# EAGLE schematic VNA (EAGLE 9.3.1)

## Sheet 1 of 10
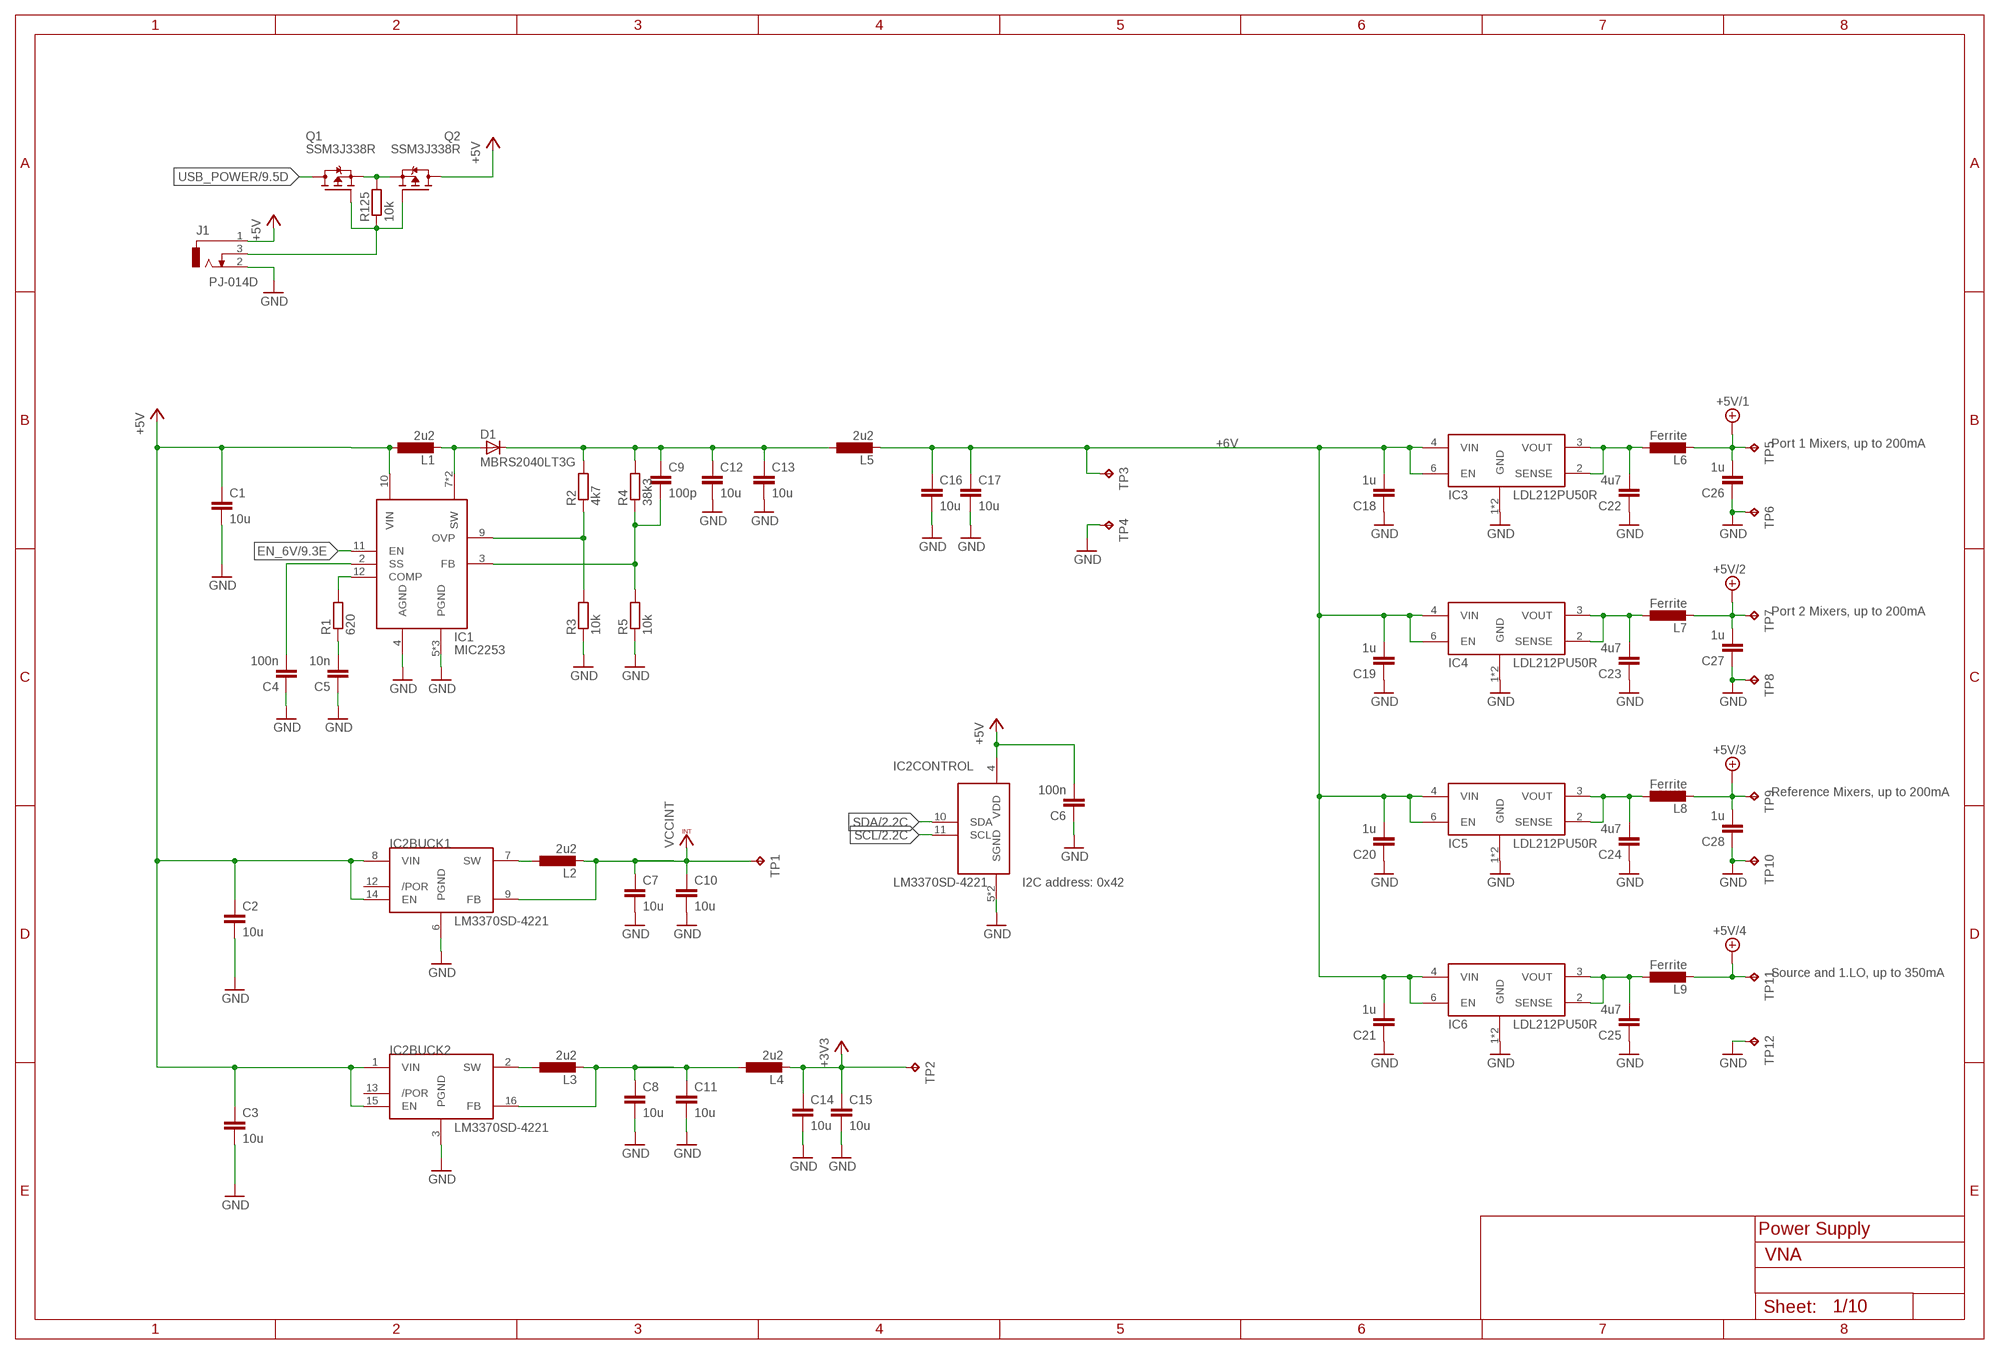
[diagram p0: schematic, sheet 1]

### Parts
C1  10u  C-EUC1206  [C1206]
C2  10u  C-EUC1206  [C1206]
C3  10u  C-EUC1206  [C1206]
C4  100n  C-EUC0402:2  [C0402]
C5  10n  C-EUC0402:2  [C0402]
C6  100n  C-EUC0402:2  [C0402]
C7  10u  C-EUC1206  [C1206]
C8  10u  C-EUC1206  [C1206]
C9  100p  C-EUC0402:2  [C0402]
C10  10u  C-EUC1206  [C1206]
C11  10u  C-EUC1206  [C1206]
C12  10u  C-EUC1206  [C1206]
C13  10u  C-EUC1206  [C1206]
C14  10u  C-EUC1206  [C1206]
C15  10u  C-EUC1206  [C1206]
C16  10u  C-EUC1206  [C1206]
C17  10u  C-EUC1206  [C1206]
C18  1u  C-EUC0603:1  [C0603]
C19  1u  C-EUC0603:1  [C0603]
C20  1u  C-EUC0603:1  [C0603]
C21  1u  C-EUC0603:1  [C0603]
C22  4u7  C-EUC0603:1  [C0603]
C23  4u7  C-EUC0603:1  [C0603]
C24  4u7  C-EUC0603:1  [C0603]
C25  4u7  C-EUC0603:1  [C0603]
C26  1u  C-EUC0603:1  [C0603]
C27  1u  C-EUC0603:1  [C0603]
C28  1u  C-EUC0603:1  [C0603]
D1  MBRS2040LT3G  D-SMB  [SMB]
IC1  MIC2253  [SON50P300X300X90-13T170X240N]
IC2  LM3370SD-4221  LM3370  [SON50P400X500X80-17T260X400N]
IC3  LDL212PU50R  [SON95P300X300X100-7T170X240N]
IC4  LDL212PU50R  [SON95P300X300X100-7T170X240N]
IC5  LDL212PU50R  [SON95P300X300X100-7T170X240N]
IC6  LDL212PU50R  [SON95P300X300X100-7T170X240N]
J1  PJ-014D  [PJ-014D]
L1  2u2  SRN5040  [SRN5040]
L2  2u2  SRN5040  [SRN5040]
L3  2u2  SRN5040  [SRN5040]
L4  2u2  SRN5040  [SRN5040]
L5  2u2  SRN5040  [SRN5040]
L6  Ferrite  FERRITE  [R0402]
L7  Ferrite  FERRITE  [R0402]
L8  Ferrite  FERRITE  [R0402]
L9  Ferrite  FERRITE  [R0402]
Q1  SSM3J338R  [SOTFL95P240X80-3N]
Q2  SSM3J338R  [SOTFL95P240X80-3N]
R1  620  R-EU_R0402  [R0402]
R2  4k7  R-EU_R0402  [R0402]
R3  10k  R-EU_R0402  [R0402]
R4  38k3  R-EU_R0402  [R0402]
R5  10k  R-EU_R0402  [R0402]
R125  10k  R-EU_R0402  [R0402]
TP1  TPB1,27  [B1,27]
TP2  TPB1,27  [B1,27]
TP3  TPB1,27  [B1,27]
TP4  TPB1,27  [B1,27]
TP5  TPB1,27  [B1,27]
TP6  TPB1,27  [B1,27]
TP7  TPB1,27  [B1,27]
TP8  TPB1,27  [B1,27]
TP9  TPB1,27  [B1,27]
TP10  TPB1,27  [B1,27]
TP11  TPB1,27  [B1,27]
TP12  TPB1,27  [B1,27]

### Nets
+3V3: C14.1 C15.1 L4.P$2 TP2.TP ; also sheet 2,3,4,5,6,7,8,9,10
+5V: C1.1 C2.1 C3.1 C6.2 IC1.10(VIN) IC2.1(BUCK2:VIN) IC2.4(CONTROL:VDD) IC2.8(BUCK1:VIN) IC2.14(BUCK1:EN) IC2.15(BUCK2:EN) J1.1 L1.P$1 Q2.3(D)
+5V/1: C26.2 L6.2 TP5.TP ; also sheet 6
+5V/2: C27.2 L7.2 TP7.TP ; also sheet 7
+5V/3: C28.2 L8.2 TP9.TP ; also sheet 8
+5V/4: L9.2 TP11.TP ; also sheet 3,5
+6V: C16.1 C17.1 C18.2 C19.2 C20.2 C21.2 IC3.4(VIN) IC3.6(EN) IC4.4(VIN) IC4.6(EN) IC5.4(VIN) IC5.6(EN) IC6.4(VIN) IC6.6(EN) L5.P$2 TP3.TP
EN_6V: IC1.11(EN) ; also sheet 9
GND: C1.2 C2.2 C3.2 C4.1 C5.1 C6.1 C7.2 C8.2 C10.2 C11.2 C12.2 C13.2 C14.2 C15.2 C16.2 C17.2 C18.1 C19.1 C20.1 C21.1 C22.1 C23.1 C24.1 C25.1 C26.1 C27.1 C28.1 IC1.4(AGND) IC1.5(PGND) IC1.6(PGND) IC1.13(PGND) IC2.3(BUCK2:PGND) IC2.5(CONTROL:SGND) IC2.6(BUCK1:PGND) IC2.17(CONTROL:SGND) IC3.1(GND) IC3.7(GND) IC4.1(GND) IC4.7(GND) IC5.1(GND) IC5.7(GND) IC6.1(GND) IC6.7(GND) J1.2 R3.1 R5.1 TP4.TP TP6.TP TP8.TP TP10.TP TP12.TP ; also sheet 2,3,4,5,6,7,8,9,10
N$34: D1.A IC1.7(SW) IC1.8(SW) L1.P$2
N$65: IC1.12(COMP) R1.2
N$100: C22.2 IC3.2(SENSE) IC3.3(VOUT) L6.1
N$158: C9.2 IC1.3(FB) R4.1 R5.2
N$161: C23.2 IC4.2(SENSE) IC4.3(VOUT) L7.1
N$162: IC1.9(OVP) R2.1 R3.2
N$164: C24.2 IC5.2(SENSE) IC5.3(VOUT) L8.1
N$165: C4.2 IC1.2(SS)
N$166: C25.2 IC6.2(SENSE) IC6.3(VOUT) L9.1
N$167: Q1.2(S) Q2.2(S) R125.2
N$168: J1.3 Q1.1(G) Q2.1(G) R125.1
N$171: IC2.7(BUCK1:SW) L2.P$1
N$177: C9.1 C12.1 C13.1 D1.C L5.P$1 R2.2 R4.2
N$181: IC2.2(BUCK2:SW) L3.P$1
N$183: C8.1 C11.1 IC2.16(BUCK2:FB) L3.P$2 L4.P$1
N$225: C5.2 R1.1
SCL: IC2.11(CONTROL:SCL) ; also sheet 2,9
SDA: IC2.10(CONTROL:SDA) ; also sheet 2,9
USB_POWER: Q1.3(D) ; also sheet 9
VCCINT: C7.1 C10.1 IC2.9(BUCK1:FB) L2.P$2 TP1.TP ; also sheet 9
Unconnected: IC2.12(BUCK1:/POR) IC2.13(BUCK2:/POR)

### Notes on the sheet
- Port 1 Mixers, up to 200mA
- Port 2 Mixers, up to 200mA
- Reference Mixers, up to 200mA
- I2C address: 0x42
- Source and 1.LO, up to 350mA
- Power Supply

## Sheet 2 of 10: CLK Generation
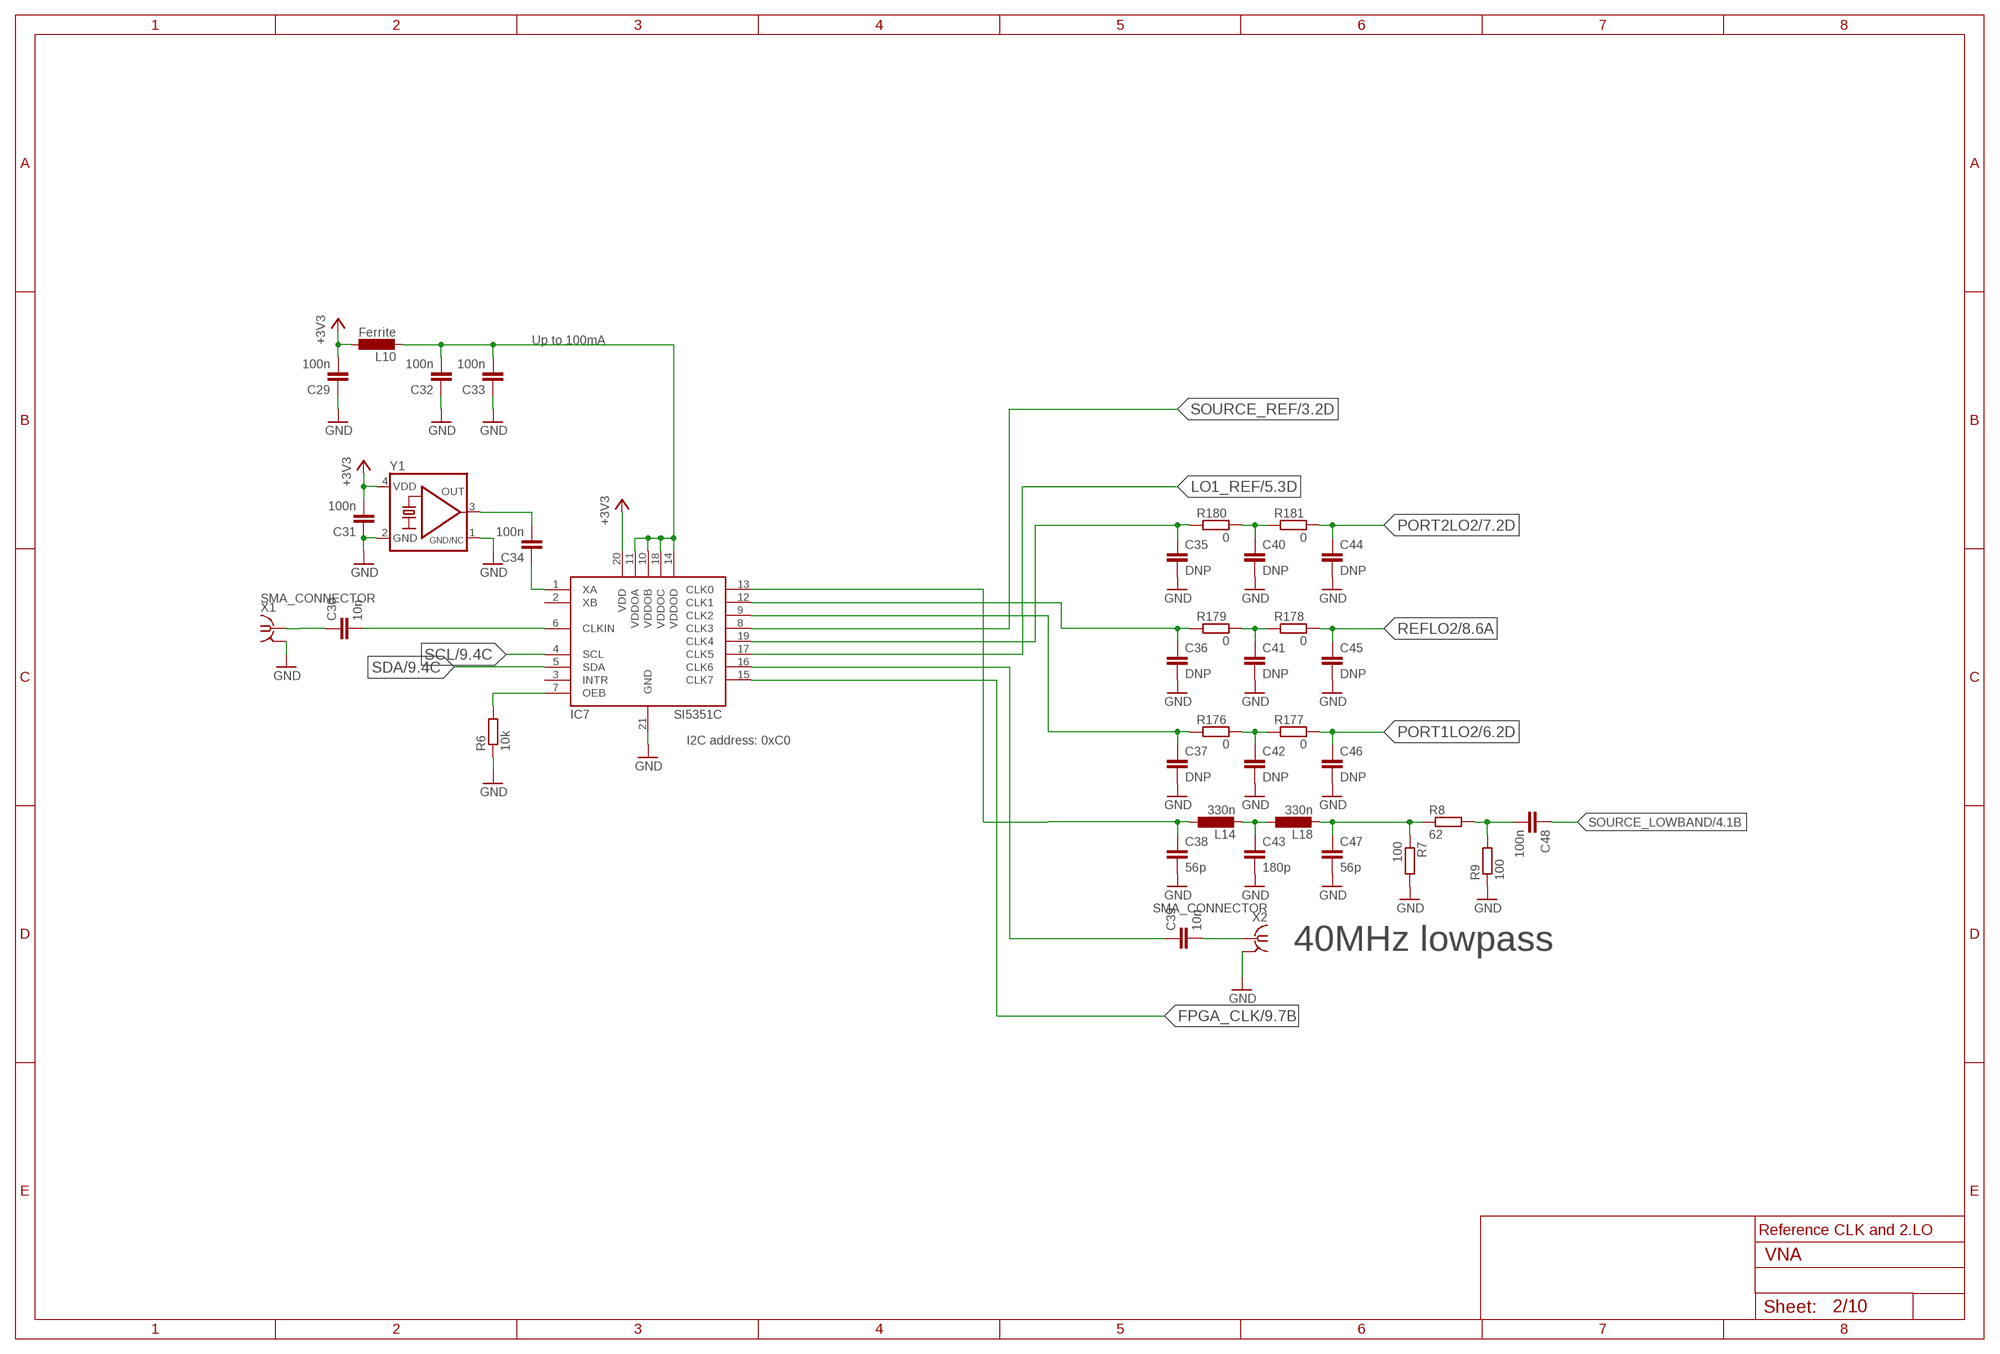
[diagram p1: schematic, sheet 2]

### Parts
C29  100n  C-EUC0402:2  [C0402]
C30  10n  C-EUC0402:2  [C0402]
C31  100n  C-EUC0402:2  [C0402]
C32  100n  C-EUC0402:2  [C0402]
C33  100n  C-EUC0402:2  [C0402]
C34  100n  C-EUC0402:2  [C0402]
C35  DNP  C-EUC0402:2  [C0402]
C36  DNP  C-EUC0402:2  [C0402]
C37  DNP  C-EUC0402:2  [C0402]
C38  56p  C-EUC0402:2  [C0402]
C39  10n  C-EUC0402:2  [C0402]
C40  DNP  C-EUC0402:2  [C0402]
C41  DNP  C-EUC0402:2  [C0402]
C42  DNP  C-EUC0402:2  [C0402]
C43  180p  C-EUC0402:2  [C0402]
C44  DNP  C-EUC0402:2  [C0402]
C45  DNP  C-EUC0402:2  [C0402]
C46  DNP  C-EUC0402:2  [C0402]
C47  56p  C-EUC0402:2  [C0402]
C48  100n  C-EUC0402:2  [C0402]
IC7  SI5351C  [QFN50P400X400X90-21T270N]
L10  Ferrite  FERRITE  [R0402]
L14  330n  INDUCTOR0402  [L0402]
L18  330n  INDUCTOR0402  [L0402]
R6  10k  R-EU_R0402  [R0402]
R7  100  R-EU_R0402  [R0402]
R8  62  R-EU_R0402  [R0402]
R9  100  R-EU_R0402  [R0402]
R176  0  R-EU_R0402  [R0402]
R177  0  R-EU_R0402  [R0402]
R178  0  R-EU_R0402  [R0402]
R179  0  R-EU_R0402  [R0402]
R180  0  R-EU_R0402  [R0402]
R181  0  R-EU_R0402  [R0402]
X1  SMA_CONNECTOR  [J502-ND-142-0711-821/826]
X2  SMA_CONNECTOR  [J502-ND-142-0711-821/826]
Y1  DSB221SDN/26MHz  KXO-TCXO-CMOS-86  [2.5X2.0_KXO-86-TCXO]

### Nets
+3V3: C29.2 C31.2 IC7.20(VDD) L10.1 Y1.4(VDD) ; also sheet 1,3,4,5,6,7,8,9,10
FPGA_CLK: IC7.15(CLK7) ; also sheet 9
GND: C29.1 C31.1 C32.1 C33.1 C35.2 C36.2 C37.2 C38.2 C40.2 C41.2 C42.2 C43.2 C44.2 C45.2 C46.2 C47.2 IC7.21(GND) R6.1 R7.2 R9.1 X1.G@1 X1.G@2 X1.G@3 X1.G@4 X2.G@1 X2.G@2 X2.G@3 X2.G@4 Y1.1(GND/NC) Y1.2(GND) ; also sheet 1,3,4,5,6,7,8,9,10
LO1_REF: IC7.17(CLK5) ; also sheet 5
N$57: C43.1 L14.2 L18.1
N$60: C39.2 X2.1
N$91: C40.1 R180.2 R181.1
N$96: C41.1 R178.1 R179.2
N$97: C36.1 IC7.12(CLK1) R179.1
N$99: C42.1 R176.2 R177.1
N$101: C35.1 IC7.19(CLK4) R180.1
N$103: C39.1 IC7.16(CLK6)
N$107: C30.1 X1.1
N$108: C30.2 IC7.6(CLKIN)
N$109: C32.2 C33.2 IC7.10(VDDOB) IC7.11(VDDOA) IC7.14(VDDOD) IC7.18(VDDOC) L10.2
N$112: IC7.7(OEB) R6.2
N$113: C34.2 Y1.3(OUT)
N$114: C34.1 IC7.1(XA)
N$157: C38.1 IC7.13(CLK0) L14.1
N$159: C48.2 R8.2 R9.2
N$160: C37.1 IC7.9(CLK2) R176.1
PORT1LO2: C46.1 R177.2 ; also sheet 6
PORT2LO2: C44.1 R181.2 ; also sheet 7
REFLO2: C45.1 R178.2 ; also sheet 8
REFLO3: C47.1 L18.2 R7.1 R8.1
SCL: IC7.4(SCL) ; also sheet 1,9
SDA: IC7.5(SDA) ; also sheet 1,9
SOURCE_LOWBAND: C48.1 ; also sheet 4
SOURCE_REF: IC7.8(CLK3) ; also sheet 3
Unconnected: IC7.2(XB) IC7.3(INTR)

### Notes on the sheet
- Up to 100mA
- I2C address: 0xC0
- 40MHz lowpass
- Reference CLK and 2.LO

## Sheet 3 of 10: Source
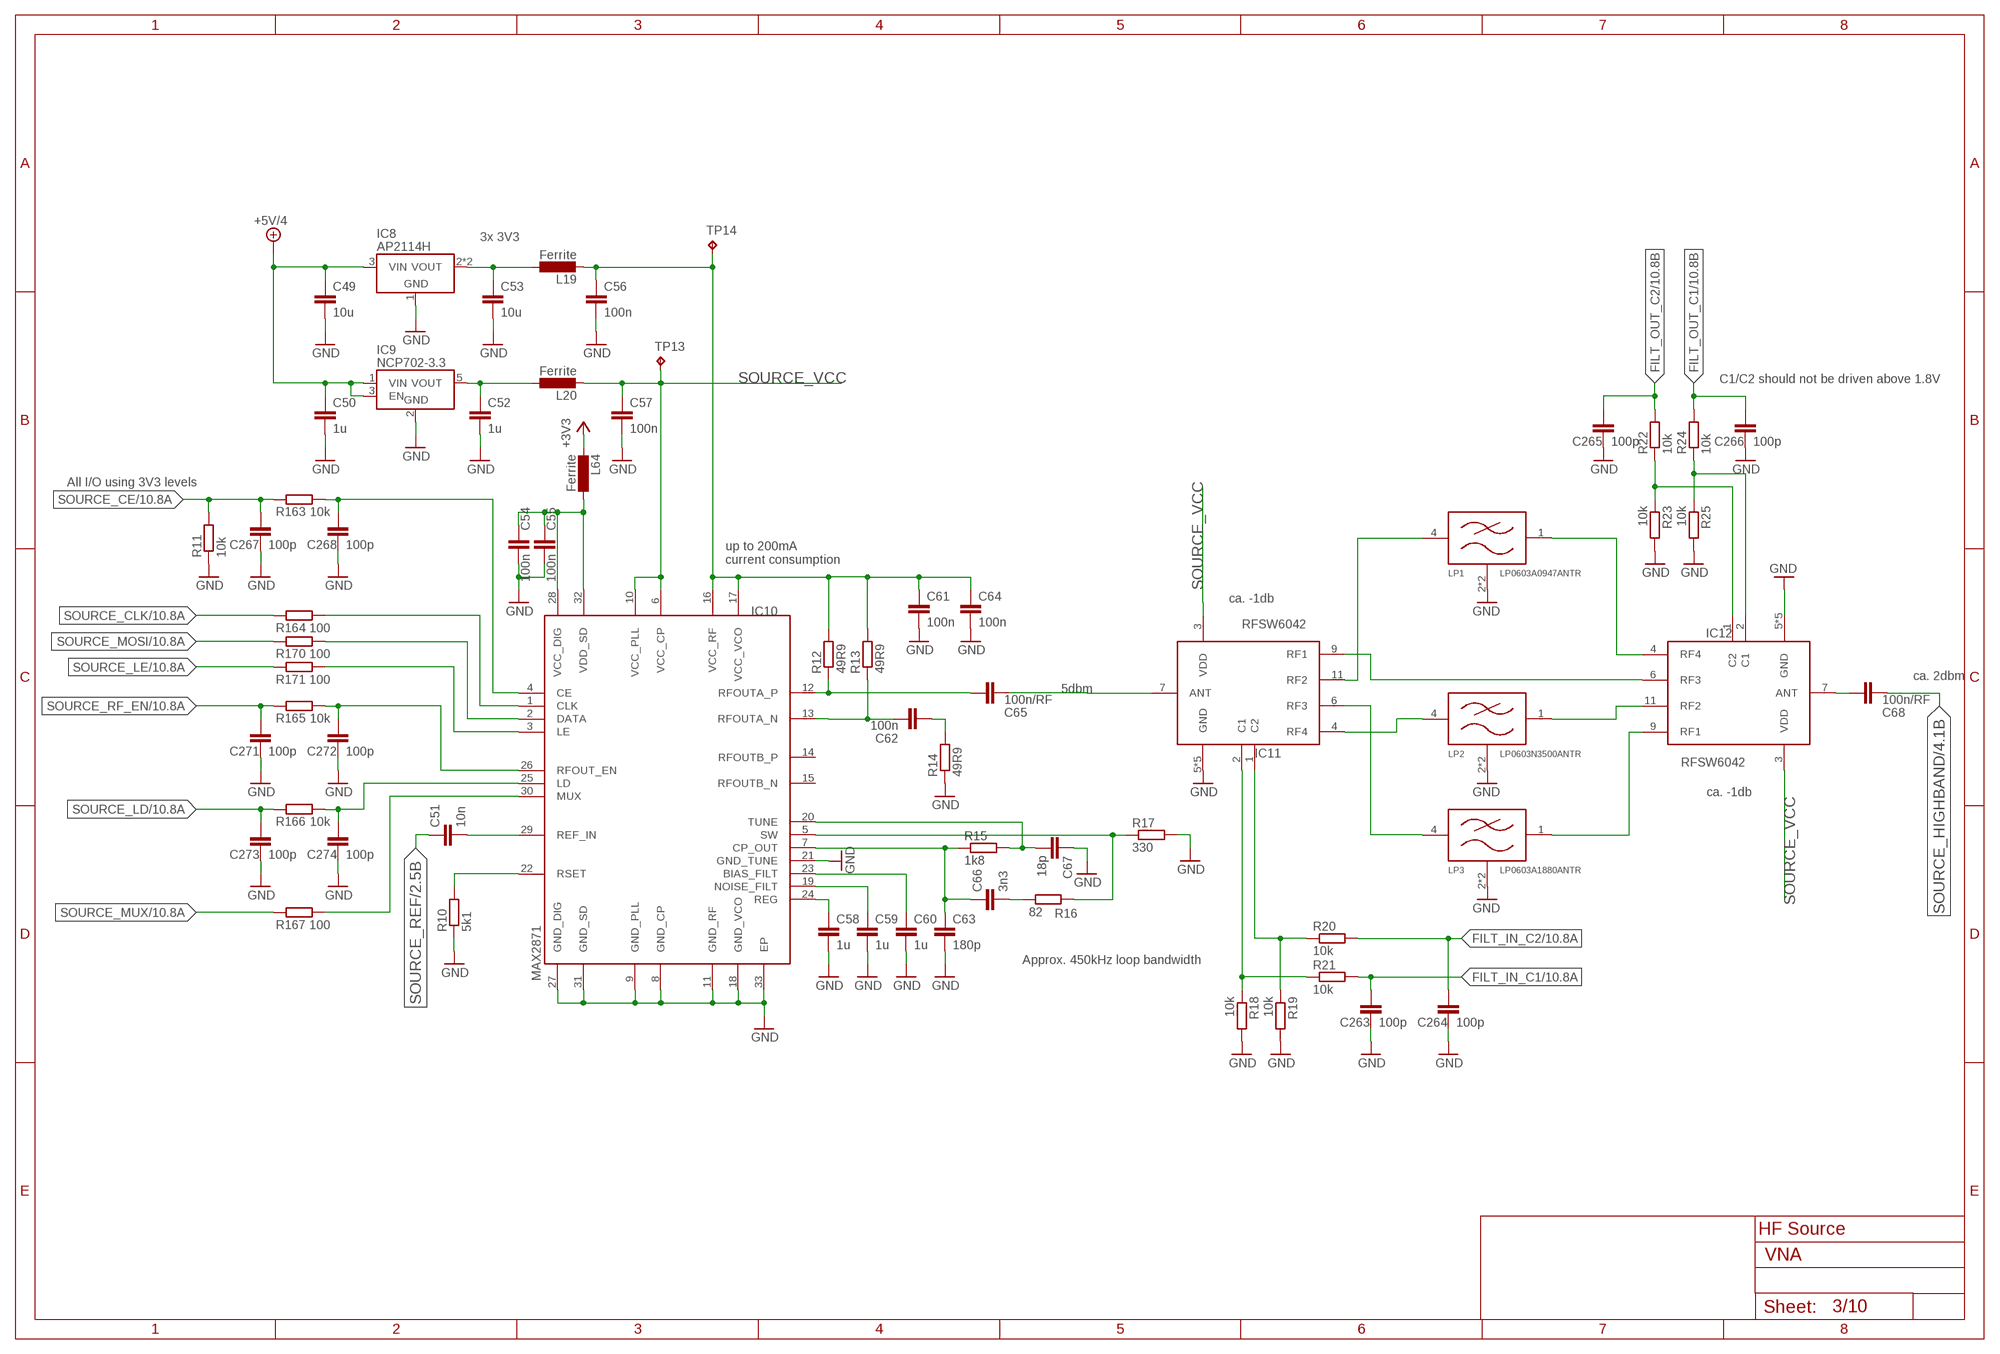
[diagram p2: schematic, sheet 3]

### Parts
C49  10u  C-EUC1206  [C1206]
C50  1u  C-EUC0603:1  [C0603]
C51  10n  C-EUC0402:2  [C0402]
C52  1u  C-EUC0603:1  [C0603]
C53  10u  C-EUC1206  [C1206]
C54  100n  C-EUC0402:2  [C0402]
C55  100n  C-EUC0402:2  [C0402]
C56  100n  C-EUC0402:2  [C0402]
C57  100n  C-EUC0402:2  [C0402]
C58  1u  C-EUC0402:2  [C0402]
C59  1u  C-EUC0402:2  [C0402]
C60  1u  C-EUC0402:2  [C0402]
C61  100n  C-EUC0402:2  [C0402]
C62  100n  C-EUC0402:2  [C0402]
C63  180p  C-EUC0402:2  [C0402]
C64  100n  C-EUC0402:2  [C0402]
C65  100n/RF  C-EUC0402:2  [C0402]
C66  3n3  C-EUC0402:2  [C0402]
C67  18p  C-EUC0402:2  [C0402]
C68  100n/RF  C-EUC0402:2  [C0402]
C263  100p  C-EUC0402:2  [C0402]
C264  100p  C-EUC0402:2  [C0402]
C265  100p  C-EUC0402:2  [C0402]
C266  100p  C-EUC0402:2  [C0402]
C267  100p  C-EUC0402:2  [C0402]
C268  100p  C-EUC0402:2  [C0402]
C271  100p  C-EUC0402:2  [C0402]
C272  100p  C-EUC0402:2  [C0402]
C273  100p  C-EUC0402:2  [C0402]
C274  100p  C-EUC0402:2  [C0402]
IC8  AP2114H  [SOT230P700X180-4]
IC9  NCP702-3.3  NCP702  [SOT95P240X110-5]
IC10  MAX2871  [QFN50P500X500X80-33T310]
IC11  RFSW6042  [QFN40P180X180X55-13T76N]
IC12  RFSW6042  [QFN40P180X180X55-13T76N]
L19  Ferrite  FERRITE  [R0402]
L20  Ferrite  FERRITE  [R0402]
L64  Ferrite  FERRITE  [R0402]
LP1  LP0603A0947ANTR  LP0603A  [FILTRDFN160X84X70-4N]
LP2  LP0603N3500ANTR  LP0603A  [FILTRDFN160X84X70-4N]
LP3  LP0603A1880ANTR  LP0603A  [FILTRDFN160X84X70-4N]
R10  5k1  R-EU_R0402  [R0402]
R11  10k  R-EU_R0402  [R0402]
R12  49R9  R-EU_R0402  [R0402]
R13  49R9  R-EU_R0402  [R0402]
R14  49R9  R-EU_R0402  [R0402]
R15  1k8  R-EU_R0402  [R0402]
R16  82  R-EU_R0402  [R0402]
R17  330  R-EU_R0402  [R0402]
R18  10k  R-EU_R0402  [R0402]
R19  10k  R-EU_R0402  [R0402]
R20  10k  R-EU_R0402  [R0402]
R21  10k  R-EU_R0402  [R0402]
R22  10k  R-EU_R0402  [R0402]
R23  10k  R-EU_R0402  [R0402]
R24  10k  R-EU_R0402  [R0402]
R25  10k  R-EU_R0402  [R0402]
R163  10k  R-EU_R0402  [R0402]
R164  100  R-EU_R0402  [R0402]
R165  10k  R-EU_R0402  [R0402]
R166  10k  R-EU_R0402  [R0402]
R167  100  R-EU_R0402  [R0402]
R170  100  R-EU_R0402  [R0402]
R171  100  R-EU_R0402  [R0402]
TP13  TPB1,27  [B1,27]
TP14  TPB1,27  [B1,27]

### Nets
+3V3: L64.2 ; also sheet 1,2,4,5,6,7,8,9,10
+5V/4: C49.1 C50.1 IC8.3(VIN) IC9.1(VIN) IC9.3(EN) ; also sheet 1,5
FILT_IN_C1: C263.1 R21.2 ; also sheet 10
FILT_IN_C2: C264.1 R20.2 ; also sheet 10
FILT_OUT_C1: C266.1 R24.2 ; also sheet 10
FILT_OUT_C2: C265.1 R22.2 ; also sheet 10
GND: C49.2 C50.2 C52.2 C53.2 C54.2 C55.2 C56.2 C57.2 C58.2 C59.2 C60.2 C61.2 C63.2 C64.2 C67.1 C263.2 C264.2 C265.2 C266.2 C267.2 C268.2 C271.2 C272.2 C273.2 C274.2 IC8.1(GND) IC9.2(GND) IC10.8(GND_CP) IC10.9(GND_PLL) IC10.11(GND_RF) IC10.18(GND_VCO) IC10.21(GND_TUNE) IC10.27(GND_DIG) IC10.31(GND_SD) IC10.33(EP) IC11.5(GND) IC11.8(GND) IC11.10(GND) IC11.12(GND) IC11.13(GND) IC12.5(GND) IC12.8(GND) IC12.10(GND) IC12.12(GND) IC12.13(GND) LP1.2(GND) LP1.3(GND) LP2.2(GND) LP2.3(GND) LP3.2(GND) LP3.3(GND) R10.1 R11.1 R14.1 R17.2 R18.2 R19.2 R23.2 R25.2 ; also sheet 1,2,4,5,6,7,8,9,10
N$64: C67.2 IC10.20(TUNE) R15.2
N$93: C63.1 C66.1 IC10.7(CP_OUT) R15.1
N$94: C58.1 IC10.24(REG)
N$98: C59.1 IC10.19(NOISE_FILT)
N$102: C60.1 IC10.23(BIAS_FILT)
N$104: C66.2 R16.1
N$105: IC10.5(SW) R16.2 R17.1
N$106: IC10.22(RSET) R10.2
N$110: C56.1 C61.1 C64.1 IC10.16(VCC_RF) IC10.17(VCC_VCO) L19.2 R12.2 R13.2 TP14.TP
N$116: C51.2 IC10.29(REF_IN)
N$117: C65.1 IC10.12(RFOUTA_P) R12.1
N$118: C62.2 IC10.13(RFOUTA_N) R13.1
N$119: C62.1 R14.2
N$120: C65.2 IC11.7(ANT)
N$121: IC11.9(RF1) IC12.6(RF3)
N$122: IC11.11(RF2) LP1.4(IN)
N$123: IC12.4(RF4) LP1.1(OUT)
N$124: IC12.11(RF2) LP2.1(OUT)
N$125: IC12.9(RF1) LP3.1(OUT)
N$126: IC11.6(RF3) LP3.4(IN)
N$127: IC11.4(RF4) LP2.4(IN)
N$128: C53.1 IC8.2(VOUT) IC8.4(VOUT) L19.1
N$129: C52.1 IC9.5(VOUT) L20.1
N$130: C68.1 IC12.7(ANT)
N$180: C268.1 IC10.4(CE) R163.1
N$199: IC11.2(C1) R18.1 R21.1
N$200: IC11.1(C2) R19.1 R20.1
N$201: IC12.1(C2) R22.1 R23.1
N$202: IC12.2(C1) R24.1 R25.1
N$226: IC10.1(CLK) R164.1
N$232: IC10.2(DATA) R170.1
N$258: IC10.3(LE) R171.1
N$261: IC10.30(MUX) R167.1
N$263: C272.1 IC10.26(RFOUT_EN) R165.1
N$266: C274.1 IC10.25(LD) R166.1
N$320: C54.1 C55.1 IC10.28(VCC_DIG) IC10.32(VDD_SD) L64.1
SOURCE_CE: C267.1 R11.2 R163.2 ; also sheet 10
SOURCE_CLK: R164.2 ; also sheet 10
SOURCE_HIGHBAND: C68.2 ; also sheet 4
SOURCE_LD: C273.1 R166.2 ; also sheet 10
SOURCE_LE: R171.2 ; also sheet 10
SOURCE_MOSI: R170.2 ; also sheet 10
SOURCE_MUX: R167.2 ; also sheet 10
SOURCE_REF: C51.1 ; also sheet 2
SOURCE_RF_EN: C271.1 R165.2 ; also sheet 10
SOURCE_VCC: C57.1 IC10.6(VCC_CP) IC10.10(VCC_PLL) IC11.3(VDD) IC12.3(VDD) L20.2 TP13.TP
Unconnected: IC10.14(RFOUTB_P) IC10.15(RFOUTB_N)

### Notes on the sheet
- 3x 3V3
- C1/C2 should not be driven above 1.8V
- All I/O using 3V3 levels
- up to 200mA
  current consumption
- ca. -1db
- ca. 2dbm
- 5dbm
- ca. -1db
- Approx. 450kHz loop bandwidth
- HF Source

## Sheet 4 of 10
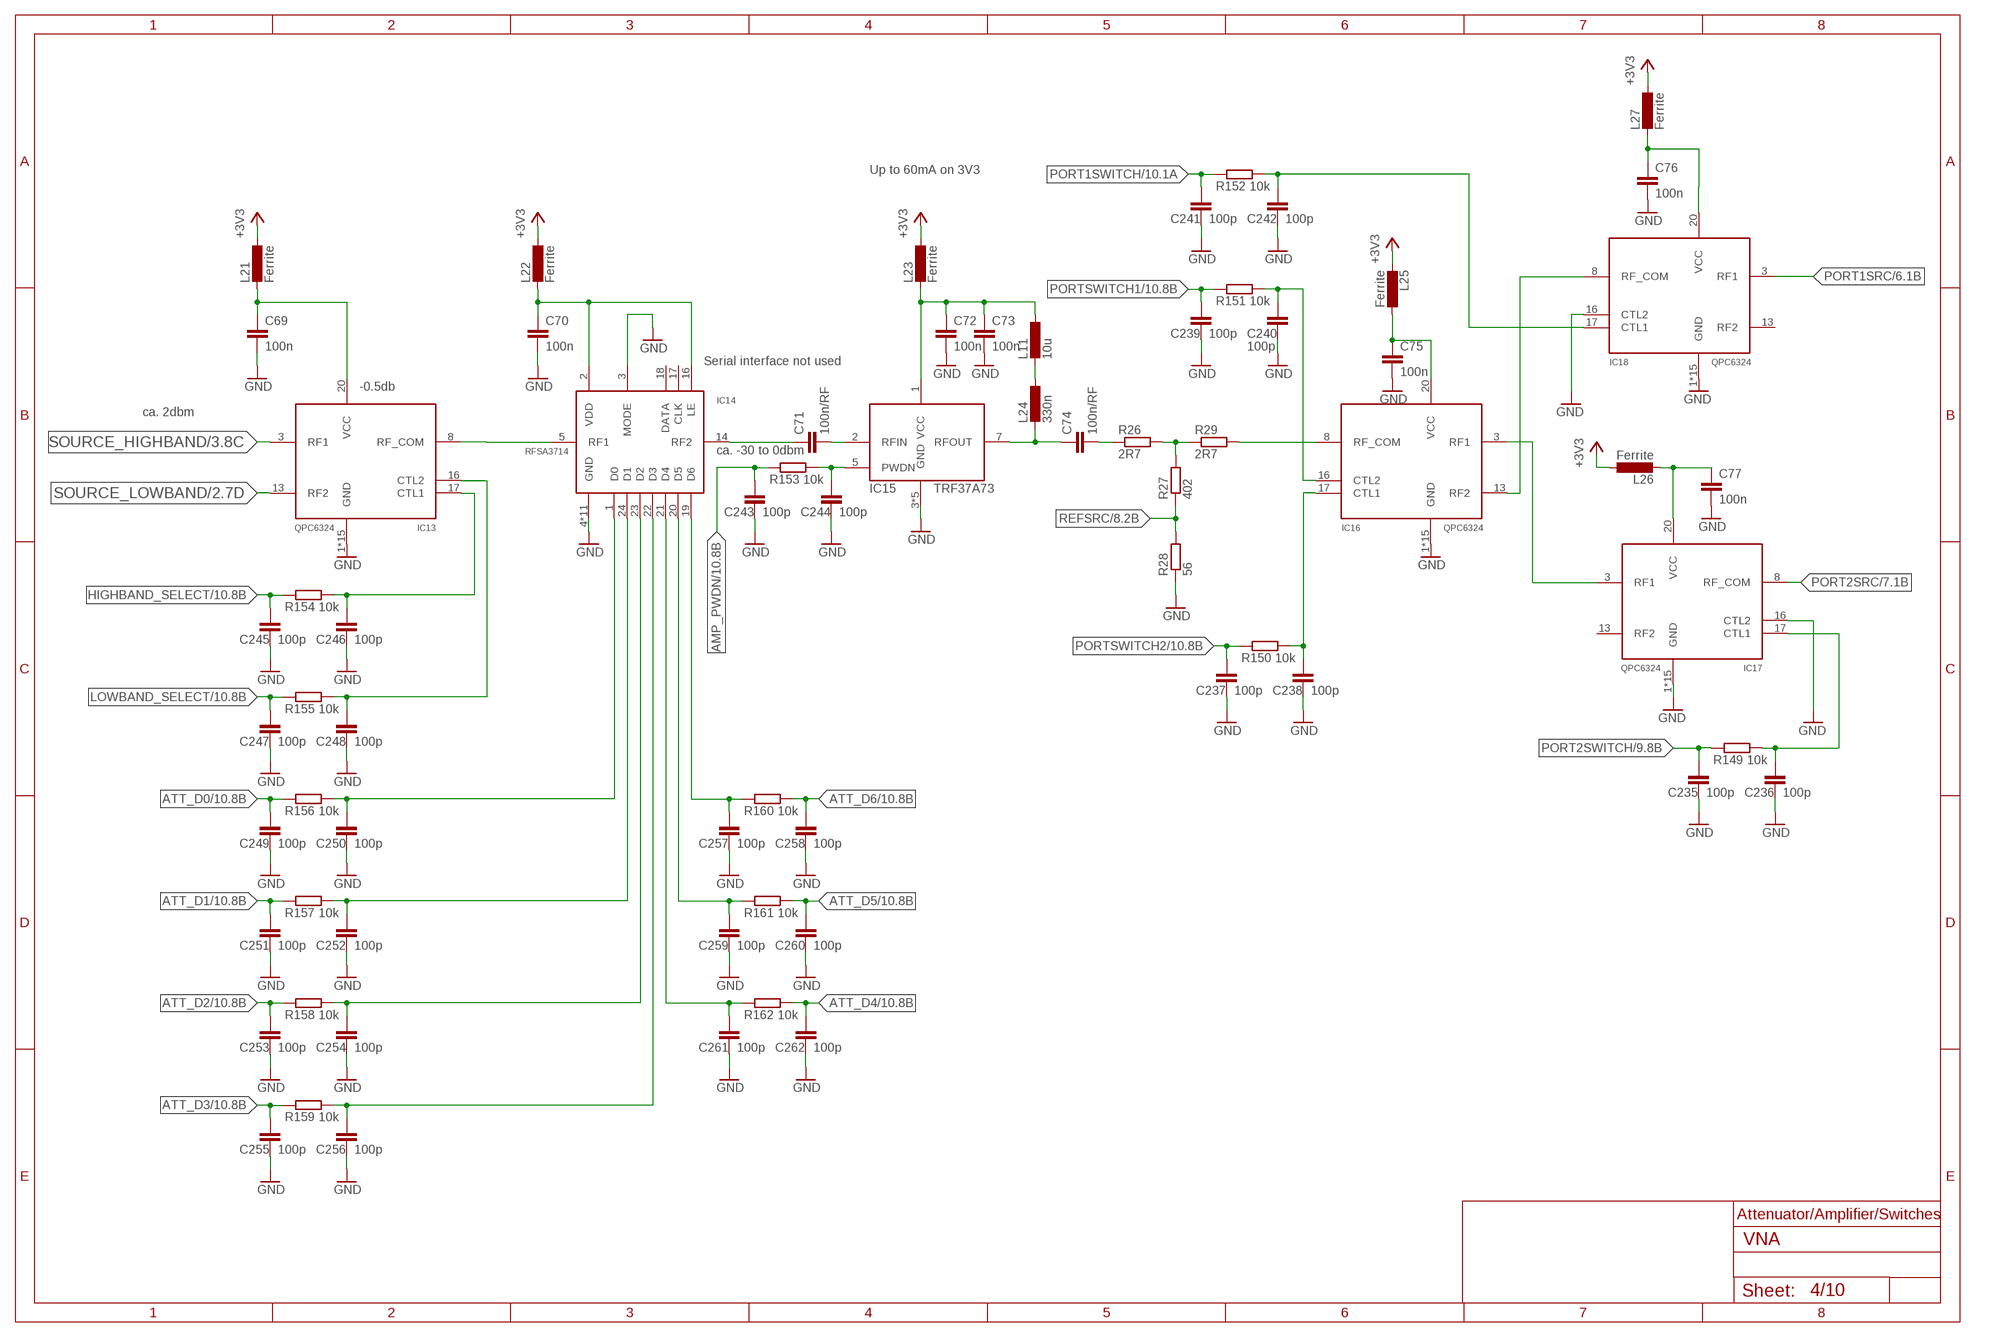
[diagram p3: schematic, sheet 4]

### Parts
C69  100n  C-EUC0402:2  [C0402]
C70  100n  C-EUC0402:2  [C0402]
C71  100n/RF  C-EUC0402:2  [C0402]
C72  100n  C-EUC0402:2  [C0402]
C73  100n  C-EUC0402:2  [C0402]
C74  100n/RF  C-EUC0402:2  [C0402]
C75  100n  C-EUC0402:2  [C0402]
C76  100n  C-EUC0402:2  [C0402]
C77  100n  C-EUC0402:2  [C0402]
C235  100p  C-EUC0402:2  [C0402]
C236  100p  C-EUC0402:2  [C0402]
C237  100p  C-EUC0402:2  [C0402]
C238  100p  C-EUC0402:2  [C0402]
C239  100p  C-EUC0402:2  [C0402]
C240  100p  C-EUC0402:2  [C0402]
C241  100p  C-EUC0402:2  [C0402]
C242  100p  C-EUC0402:2  [C0402]
C243  100p  C-EUC0402:2  [C0402]
C244  100p  C-EUC0402:2  [C0402]
C245  100p  C-EUC0402:2  [C0402]
C246  100p  C-EUC0402:2  [C0402]
C247  100p  C-EUC0402:2  [C0402]
C248  100p  C-EUC0402:2  [C0402]
C249  100p  C-EUC0402:2  [C0402]
C250  100p  C-EUC0402:2  [C0402]
C251  100p  C-EUC0402:2  [C0402]
C252  100p  C-EUC0402:2  [C0402]
C253  100p  C-EUC0402:2  [C0402]
C254  100p  C-EUC0402:2  [C0402]
C255  100p  C-EUC0402:2  [C0402]
C256  100p  C-EUC0402:2  [C0402]
C257  100p  C-EUC0402:2  [C0402]
C258  100p  C-EUC0402:2  [C0402]
C259  100p  C-EUC0402:2  [C0402]
C260  100p  C-EUC0402:2  [C0402]
C261  100p  C-EUC0402:2  [C0402]
C262  100p  C-EUC0402:2  [C0402]
IC13  QPC6324  [QFN50P400X400X75-21T206]
IC14  RFSA3714  [QFN50P400X400X75-25T270]
IC15  TRF37A73  [SON50P200X200X80-9T90X160N]
IC16  QPC6324  [QFN50P400X400X75-21T206]
IC17  QPC6324  [QFN50P400X400X75-21T206]
IC18  QPC6324  [QFN50P400X400X75-21T206]
L11  10u  INDUCTOR  [INDC2012X100N]
L21  Ferrite  FERRITE  [R0402]
L22  Ferrite  FERRITE  [R0402]
L23  Ferrite  FERRITE  [R0402]
L24  330n  INDUCTOR0402  [L0402]
L25  Ferrite  FERRITE  [R0402]
L26  Ferrite  FERRITE  [R0402]
L27  Ferrite  FERRITE  [R0402]
R26  2R7  R-EU_R0402  [R0402]
R27  402  R-EU_R0402  [R0402]
R28  56  R-EU_R0402  [R0402]
R29  2R7  R-EU_R0402  [R0402]
R149  10k  R-EU_R0402  [R0402]
R150  10k  R-EU_R0402  [R0402]
R151  10k  R-EU_R0402  [R0402]
R152  10k  R-EU_R0402  [R0402]
R153  10k  R-EU_R0402  [R0402]
R154  10k  R-EU_R0402  [R0402]
R155  10k  R-EU_R0402  [R0402]
R156  10k  R-EU_R0402  [R0402]
R157  10k  R-EU_R0402  [R0402]
R158  10k  R-EU_R0402  [R0402]
R159  10k  R-EU_R0402  [R0402]
R160  10k  R-EU_R0402  [R0402]
R161  10k  R-EU_R0402  [R0402]
R162  10k  R-EU_R0402  [R0402]

### Nets
+3V3: L21.1 L22.1 L23.1 L25.2 L26.1 L27.1 ; also sheet 1,2,3,5,6,7,8,9,10
AMP_PWDN: C243.1 R153.2 ; also sheet 10
ATT_D0: C249.1 R156.2 ; also sheet 10
ATT_D1: C251.1 R157.2 ; also sheet 10
ATT_D2: C253.1 R158.2 ; also sheet 10
ATT_D3: C255.1 R159.2 ; also sheet 10
ATT_D4: C262.1 R162.1 ; also sheet 10
ATT_D5: C260.1 R161.1 ; also sheet 10
ATT_D6: C258.1 R160.1 ; also sheet 10
GND: C69.2 C70.2 C72.2 C73.2 C75.2 C76.2 C77.2 C235.2 C236.2 C237.2 C238.2 C239.2 C240.2 C241.2 C242.2 C243.2 C244.2 C245.2 C246.2 C247.2 C248.2 C249.2 C250.2 C251.2 C252.2 C253.2 C254.2 C255.2 C256.2 C257.2 C258.2 C259.2 C260.2 C261.2 C262.2 IC13.1(GND) IC13.2(GND) IC13.4(GND) IC13.5(GND) IC13.6(GND) IC13.7(GND) IC13.9(GND) IC13.10(GND) IC13.11(GND) IC13.12(GND) IC13.14(GND) IC13.15(GND) IC13.18(GND) IC13.19(GND) IC13.21(GND) IC14.3(MODE) IC14.4(GND) IC14.6(GND) IC14.7(GND) IC14.8(GND) IC14.9(GND) IC14.10(GND) IC14.11(GND) IC14.12(GND) IC14.13(GND) IC14.15(GND) IC14.25(GND) IC15.3(GND) IC15.4(GND) IC15.6(GND) IC15.8(GND) IC15.9(GND) IC16.1(GND) IC16.2(GND) IC16.4(GND) IC16.5(GND) IC16.6(GND) IC16.7(GND) IC16.9(GND) IC16.10(GND) IC16.11(GND) IC16.12(GND) IC16.14(GND) IC16.15(GND) IC16.18(GND) IC16.19(GND) IC16.21(GND) IC17.1(GND) IC17.2(GND) IC17.4(GND) IC17.5(GND) IC17.6(GND) IC17.7(GND) IC17.9(GND) IC17.10(GND) IC17.11(GND) IC17.12(GND) IC17.14(GND) IC17.15(GND) IC17.16(CTL2) IC17.18(GND) IC17.19(GND) IC17.21(GND) IC18.1(GND) IC18.2(GND) IC18.4(GND) IC18.5(GND) IC18.6(GND) IC18.7(GND) IC18.9(GND) IC18.10(GND) IC18.11(GND) IC18.12(GND) IC18.14(GND) IC18.15(GND) IC18.16(CTL2) IC18.18(GND) IC18.19(GND) IC18.21(GND) R28.1 ; also sheet 1,2,3,5,6,7,8,9,10
HIGHBAND_SELECT: C245.1 R154.2 ; also sheet 10
LOWBAND_SELECT: C247.1 R155.2 ; also sheet 10
N$51: C77.1 IC17.20(VCC) L26.2
N$140: C69.1 IC13.20(VCC) L21.2
N$144: IC13.8(RF_COM) IC14.5(RF1)
N$145: C70.1 IC14.2(VDD) IC14.16(LE) L22.2
N$146: C71.1 IC14.14(RF2)
N$148: C71.2 IC15.2(RFIN)
N$149: C74.1 IC15.7(RFOUT) L24.2
N$150: C74.2 R26.1
N$151: IC16.8(RF_COM) R29.2
N$152: C72.1 C73.1 IC15.1(VCC) L11.1 L23.2
N$153: R26.2 R27.2 R29.1
N$154: IC16.13(RF2) IC18.8(RF_COM)
N$155: IC16.3(RF1) IC17.3(RF1)
N$156: C76.1 IC18.20(VCC) L27.2
N$174: C236.1 IC17.17(CTL1) R149.1
N$176: C240.1 IC16.16(CTL2) R151.1
N$178: C238.1 IC16.17(CTL1) R150.1
N$182: C242.1 IC18.17(CTL1) R152.1
N$184: C244.1 IC15.5(PWDN) R153.1
N$185: C246.1 IC13.17(CTL1) R154.1
N$192: C250.1 IC14.1(D0) R156.1
N$193: C248.1 IC13.16(CTL2) R155.1
N$227: C252.1 IC14.24(D1) R157.1
N$235: C75.1 IC16.20(VCC) L25.1
N$257: C254.1 IC14.23(D2) R158.1
N$259: C256.1 IC14.22(D3) R159.1
N$260: C257.1 IC14.19(D6) R160.2
N$262: C259.1 IC14.20(D5) R161.2
N$264: C261.1 IC14.21(D4) R162.2
N$270: L11.2 L24.1
PORT1SRC: IC18.3(RF1) ; also sheet 6
PORT1SWITCH: C241.1 R152.2 ; also sheet 10
PORT2SRC: IC17.8(RF_COM) ; also sheet 7
PORT2SWITCH: C235.1 R149.2 ; also sheet 9
PORTSWITCH1: C239.1 R151.2 ; also sheet 10
PORTSWITCH2: C237.1 R150.2 ; also sheet 10
REFSRC: R27.1 R28.2 ; also sheet 8
SOURCE_HIGHBAND: IC13.3(RF1) ; also sheet 3
SOURCE_LOWBAND: IC13.13(RF2) ; also sheet 2
Unconnected: IC14.17(CLK) IC14.18(DATA) IC17.13(RF2) IC18.13(RF2)

### Notes on the sheet
- Up to 60mA on 3V3
- Serial interface not used
- -0.5db
- ca. 2dbm
- ca. -30 to 0dbm
- Attenuator/Amplifier/Switches

## Sheet 5 of 10: 1. LO
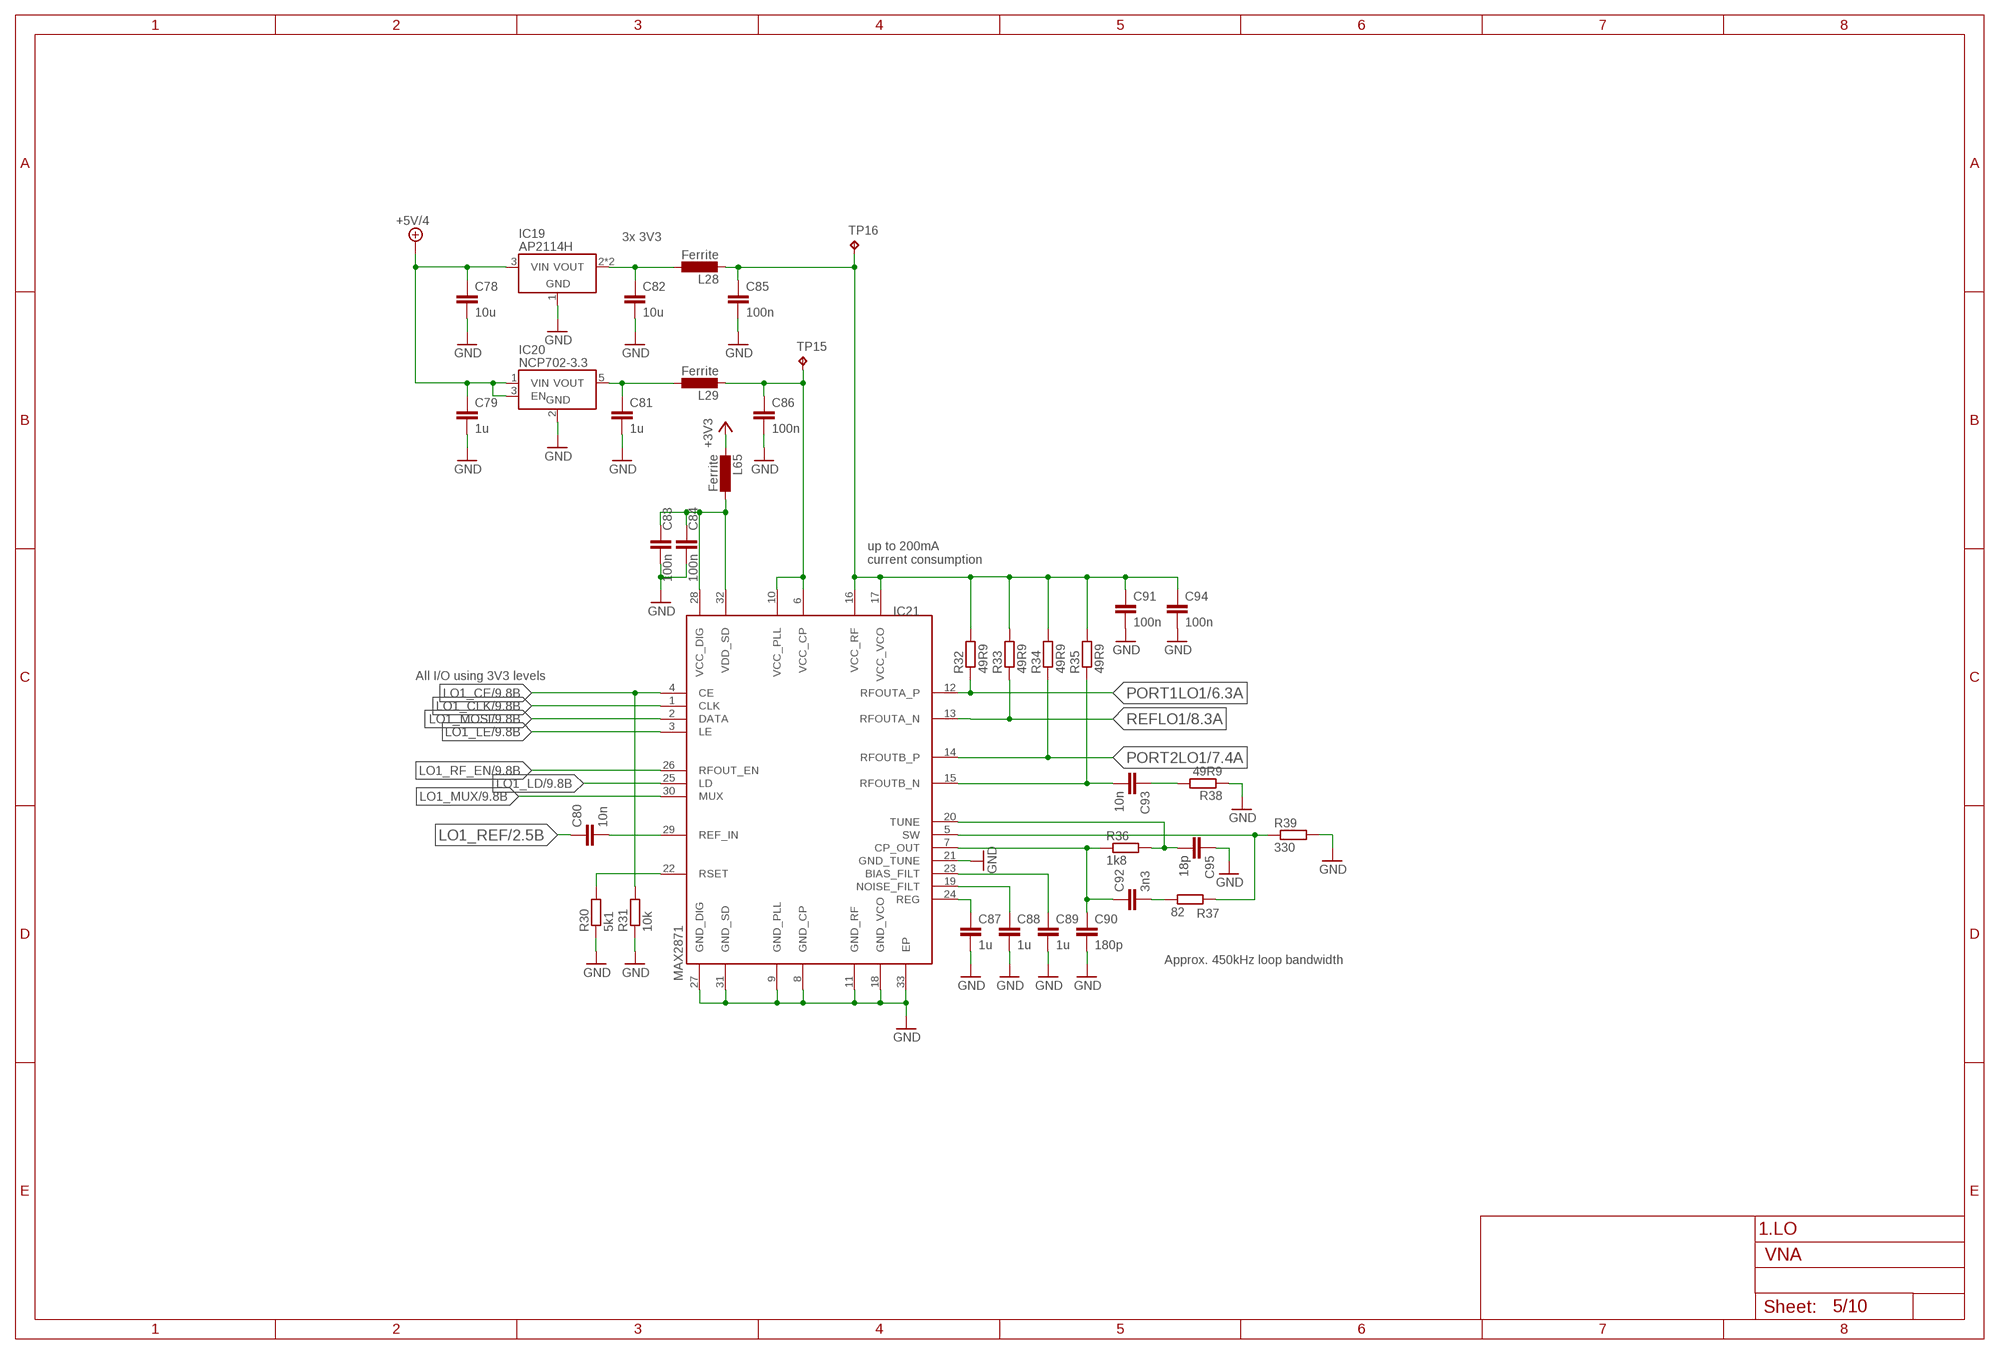
[diagram p4: schematic, sheet 5]

### Parts
C78  10u  C-EUC1206  [C1206]
C79  1u  C-EUC0603:1  [C0603]
C80  10n  C-EUC0402:2  [C0402]
C81  1u  C-EUC0603:1  [C0603]
C82  10u  C-EUC1206  [C1206]
C83  100n  C-EUC0402:2  [C0402]
C84  100n  C-EUC0402:2  [C0402]
C85  100n  C-EUC0402:2  [C0402]
C86  100n  C-EUC0402:2  [C0402]
C87  1u  C-EUC0402:2  [C0402]
C88  1u  C-EUC0402:2  [C0402]
C89  1u  C-EUC0402:2  [C0402]
C90  180p  C-EUC0402:2  [C0402]
C91  100n  C-EUC0402:2  [C0402]
C92  3n3  C-EUC0402:2  [C0402]
C93  10n  C-EUC0402:2  [C0402]
C94  100n  C-EUC0402:2  [C0402]
C95  18p  C-EUC0402:2  [C0402]
IC19  AP2114H  [SOT230P700X180-4]
IC20  NCP702-3.3  NCP702  [SOT95P240X110-5]
IC21  MAX2871  [QFN50P500X500X80-33T310]
L28  Ferrite  FERRITE  [R0402]
L29  Ferrite  FERRITE  [R0402]
L65  Ferrite  FERRITE  [R0402]
R30  5k1  R-EU_R0402  [R0402]
R31  10k  R-EU_R0402  [R0402]
R32  49R9  R-EU_R0402  [R0402]
R33  49R9  R-EU_R0402  [R0402]
R34  49R9  R-EU_R0402  [R0402]
R35  49R9  R-EU_R0402  [R0402]
R36  1k8  R-EU_R0402  [R0402]
R37  82  R-EU_R0402  [R0402]
R38  49R9  R-EU_R0402  [R0402]
R39  330  R-EU_R0402  [R0402]
TP15  TPB1,27  [B1,27]
TP16  TPB1,27  [B1,27]

### Nets
+3V3: L65.2 ; also sheet 1,2,3,4,6,7,8,9,10
+5V/4: C78.1 C79.1 IC19.3(VIN) IC20.1(VIN) IC20.3(EN) ; also sheet 1,3
GND: C78.2 C79.2 C81.2 C82.2 C83.2 C84.2 C85.2 C86.2 C87.2 C88.2 C89.2 C90.2 C91.2 C94.2 C95.1 IC19.1(GND) IC20.2(GND) IC21.8(GND_CP) IC21.9(GND_PLL) IC21.11(GND_RF) IC21.18(GND_VCO) IC21.21(GND_TUNE) IC21.27(GND_DIG) IC21.31(GND_SD) IC21.33(EP) R30.1 R31.1 R38.1 R39.2 ; also sheet 1,2,3,4,6,7,8,9,10
LO1_CE: IC21.4(CE) R31.2 ; also sheet 9
LO1_CLK: IC21.1(CLK) ; also sheet 9
LO1_LD: IC21.25(LD) ; also sheet 9
LO1_LE: IC21.3(LE) ; also sheet 9
LO1_MOSI: IC21.2(DATA) ; also sheet 9
LO1_MUX: IC21.30(MUX) ; also sheet 9
LO1_REF: C80.1 ; also sheet 2
LO1_RF_EN: IC21.26(RFOUT_EN) ; also sheet 9
N$111: C86.1 IC21.6(VCC_CP) IC21.10(VCC_PLL) L29.2 TP15.TP
N$115: C95.2 IC21.20(TUNE) R36.2
N$131: C90.1 C92.1 IC21.7(CP_OUT) R36.1
N$132: C87.1 IC21.24(REG)
N$133: C88.1 IC21.19(NOISE_FILT)
N$134: C89.1 IC21.23(BIAS_FILT)
N$135: C92.2 R37.1
N$136: IC21.5(SW) R37.2 R39.1
N$137: IC21.22(RSET) R30.2
N$138: C85.1 C91.1 C94.1 IC21.16(VCC_RF) IC21.17(VCC_VCO) L28.2 R32.2 R33.2 R34.2 R35.2 TP16.TP
N$139: C80.2 IC21.29(REF_IN)
N$141: C93.1 R38.2
N$142: C82.1 IC19.2(VOUT) IC19.4(VOUT) L28.1
N$143: C81.1 IC20.5(VOUT) L29.1
N$147: C93.2 IC21.15(RFOUTB_N) R35.1
N$322: C83.1 C84.1 IC21.28(VCC_DIG) IC21.32(VDD_SD) L65.1
PORT1LO1: IC21.12(RFOUTA_P) R32.1 ; also sheet 6
PORT2LO1: IC21.14(RFOUTB_P) R34.1 ; also sheet 7
REFLO1: IC21.13(RFOUTA_N) R33.1 ; also sheet 8

### Notes on the sheet
- 3x 3V3
- up to 200mA
  current consumption
- All I/O using 3V3 levels
- Approx. 450kHz loop bandwidth
- 1.LO

## Sheet 6 of 10: Port 1
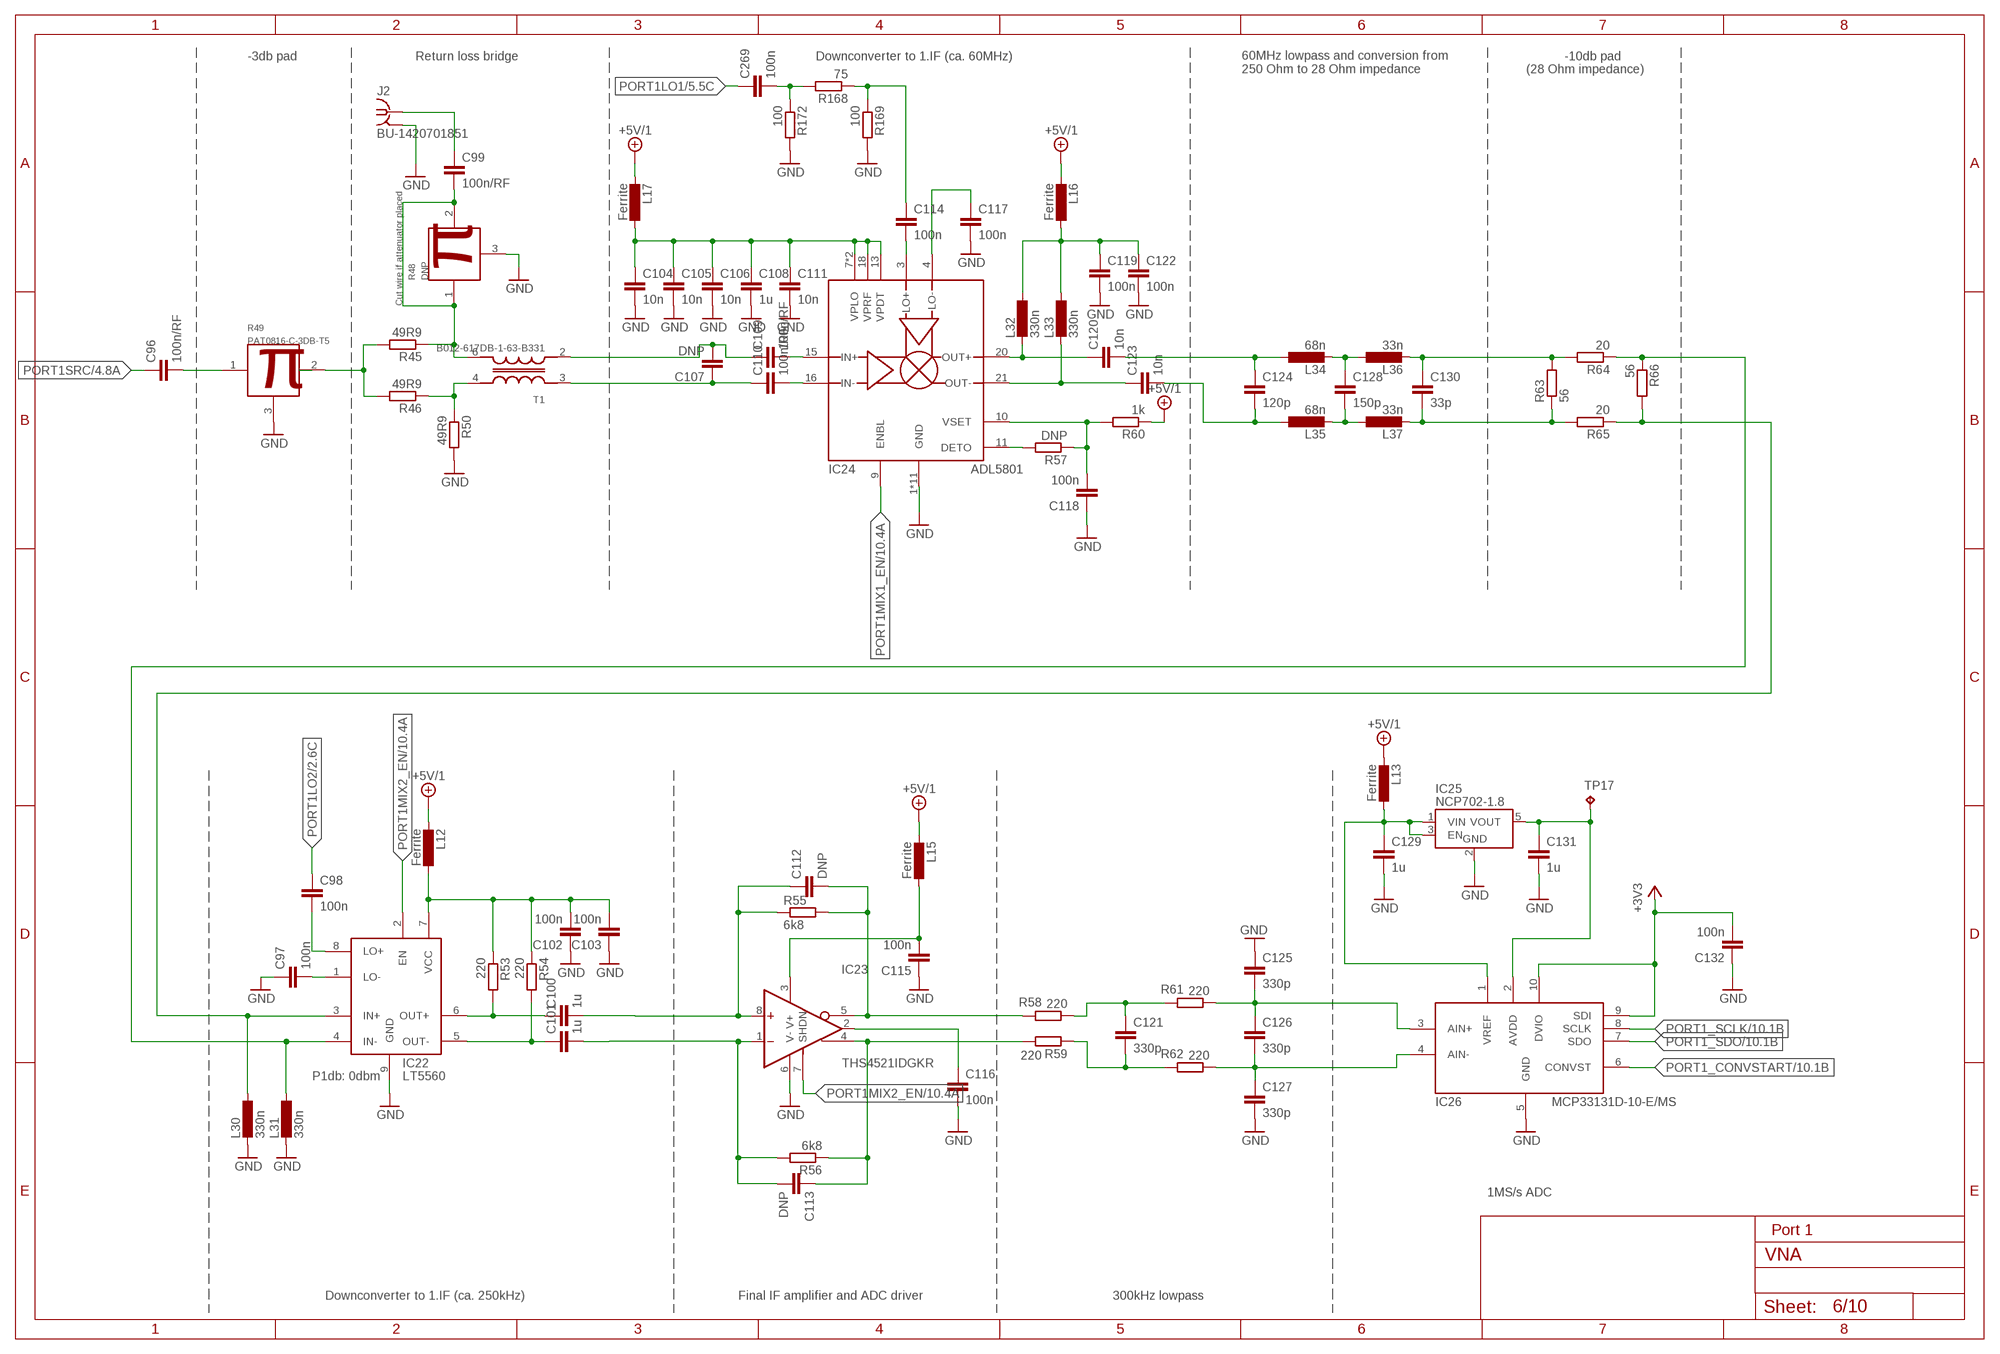
[diagram p5: schematic, sheet 6]

### Parts
C96  100n/RF  C-EUC0402:2  [C0402]
C97  100n  C-EUC0402:2  [C0402]
C98  100n  C-EUC0402:2  [C0402]
C99  100n/RF  C-EUC0402:2  [C0402]
C100  1u  C-EUC0402:2  [C0402]
C101  1u  C-EUC0402:2  [C0402]
C102  100n  C-EUC0402:2  [C0402]
C103  100n  C-EUC0402:2  [C0402]
C104  10n  C-EUC0402:2  [C0402]
C105  10n  C-EUC0402:2  [C0402]
C106  10n  C-EUC0402:2  [C0402]
C107  DNP  C-EUC0402:2  [C0402]
C108  1u  C-EUC0402:2  [C0402]
C109  100n/RF  C-EUC0402:2  [C0402]
C110  100n/RF  C-EUC0402:2  [C0402]
C111  10n  C-EUC0402:2  [C0402]
C112  DNP  C-EUC0402:2  [C0402]
C113  DNP  C-EUC0402:2  [C0402]
C114  100n  C-EUC0402:2  [C0402]
C115  100n  C-EUC0402:2  [C0402]
C116  100n  C-EUC0402:2  [C0402]
C117  100n  C-EUC0402:2  [C0402]
C118  100n  C-EUC0402:2  [C0402]
C119  100n  C-EUC0402:2  [C0402]
C120  10n  C-EUC0402:2  [C0402]
C121  330p  C-EUC0402:2  [C0402]
C122  100n  C-EUC0402:2  [C0402]
C123  10n  C-EUC0402:2  [C0402]
C124  120p  C-EUC0402:2  [C0402]
C125  330p  C-EUC0402:2  [C0402]
C126  330p  C-EUC0402:2  [C0402]
C127  330p  C-EUC0402:2  [C0402]
C128  150p  C-EUC0402:2  [C0402]
C129  1u  C-EUC0402:2  [C0402]
C130  33p  C-EUC0402:2  [C0402]
C131  1u  C-EUC0402:2  [C0402]
C132  100n  C-EUC0402:2  [C0402]
C269  100n  C-EUC0402:2  [C0402]
IC22  LT5560  [SON50P300X300X80-9T165X238]
IC23  THS4521IDGKR  [SOP65P490X110-8N]
IC24  ADL5801  [QFN50P400X400X100-25T250N]
IC25  NCP702-1.8  NCP702  [SOT95P240X110-5]
IC26  MCP33131D-10-E/MS  [SOP50P490X110-10N]
J2  BU-1420701851  [BU-1420701851]
L12  Ferrite  FERRITE  [R0402]
L13  Ferrite  FERRITE  [R0402]
L15  Ferrite  FERRITE  [R0402]
L16  Ferrite  FERRITE  [R0402]
L17  Ferrite  FERRITE  [R0402]
L30  330n  INDUCTOR0402  [L0402]
L31  330n  INDUCTOR0402  [L0402]
L32  330n  INDUCTOR0402  [L0402]
L33  330n  INDUCTOR0402  [L0402]
L34  68n  INDUCTOR0402  [L0402]
L35  68n  INDUCTOR0402  [L0402]
L36  33n  INDUCTOR0402  [L0402]
L37  33n  INDUCTOR0402  [L0402]
R45  49R9  R-EU_R0402  [R0402]
R46  49R9  R-EU_R0402  [R0402]
R48  DNP  PAT0816-C-3DB-T5  [PAT0816]
R49  PAT0816-C-3DB-T5  [PAT0816]
R50  49R9  R-EU_R0402  [R0402]
R53  220  R-EU_R0402  [R0402]
R54  220  R-EU_R0402  [R0402]
R55  6k8  R-EU_R0402  [R0402]
R56  6k8  R-EU_R0402  [R0402]
R57  DNP  R-EU_R0402  [R0402]
R58  220  R-EU_R0402  [R0402]
R59  220  R-EU_R0402  [R0402]
R60  1k  R-EU_R0402  [R0402]
R61  220  R-EU_R0402  [R0402]
R62  220  R-EU_R0402  [R0402]
R63  56  R-EU_R0402  [R0402]
R64  20  R-EU_R0402  [R0402]
R65  20  R-EU_R0402  [R0402]
R66  56  R-EU_R0402  [R0402]
R168  75  R-EU_R0402  [R0402]
R169  100  R-EU_R0402  [R0402]
R172  100  R-EU_R0402  [R0402]
T1  B012-617DB-1-63-B331  [EASTEVER_BALUN]
TP17  TPB1,27  [B1,27]

### Nets
+3V3: C132.2 IC26.9(SDI) IC26.10(DVIO) ; also sheet 1,2,3,4,5,7,8,9,10
+5V/1: L12.2 L13.2 L15.2 L16.2 L17.2 R60.1 ; also sheet 1
GND: C97.1 C102.1 C103.1 C104.2 C105.2 C106.2 C108.2 C111.2 C115.1 C116.2 C117.2 C118.1 C119.2 C122.2 C125.1 C127.2 C129.2 C131.2 C132.1 IC22.9(GND) IC23.6(V-) IC24.1(GND) IC24.2(GND) IC24.5(GND) IC24.6(GND) IC24.8(GND) IC24.12(GND) IC24.14(GND) IC24.17(GND) IC24.19(GND) IC24.23(GND) IC24.25(GND) IC25.2(GND) IC26.5(GND) J2.G@1 J2.G@2 J2.G@3 J2.G@4 L30.2 L31.2 R48.3(GND) R49.3(GND) R50.2 R169.2 R172.2 ; also sheet 1,2,3,4,5,7,8,9,10
N$1: C96.2 R49.1(IN)
N$2: R45.2 R46.2 R49.2(OUT)
N$3: C120.2 C124.1 L34.1
N$5: R46.1 R50.1 T1.4(OUT+)
N$6: C99.1 J2.1
N$7: C109.2 IC24.15(IN+)
N$8: C110.2 IC24.16(IN-)
N$9: C107.1 C110.1 T1.3(IN+)
N$10: C107.2 C109.1 T1.2(IN-)
N$11: C117.1 IC24.4(LO-)
N$12: C114.2 IC24.3(LO+)
N$13: C125.2 C126.1 IC26.3(AIN+) R61.1
N$14: C120.1 IC24.20(OUT+) L32.2
N$15: C123.1 IC24.21(OUT-) L33.2
N$16: C123.2 C124.2 L35.1
N$17: C128.2 L35.2 L37.1
N$18: C98.2 IC22.8(LO+)
N$19: C118.2 IC24.10(VSET) R57.1 R60.2
N$20: C126.2 C127.1 IC26.4(AIN-) R62.1
N$24: C97.2 IC22.1(LO-)
N$25: C102.2 C103.2 IC22.7(VCC) L12.1 R53.1 R54.1
N$27: C100.1 IC22.6(OUT+) R53.2
N$28: C101.1 IC22.5(OUT-) R54.2
N$31: C113.1 IC23.4(+OUT) R56.1 R59.2
N$32: C112.2 IC23.5(-OUT) R55.2 R58.2
N$33: C128.1 L34.2 L36.1
N$62: C130.1 L36.2 R63.2 R64.2
N$63: C130.2 L37.2 R63.1 R65.2
N$92: C101.2 C113.2 IC23.1(-IN) R56.2
N$95: C100.2 C112.1 IC23.8(+IN) R55.1
N$203: C131.1 IC25.5(VOUT) IC26.2(AVDD) TP17.TP
N$217: IC22.4(IN-) L31.1 R64.1 R66.1
N$218: IC22.3(IN+) L30.1 R65.1 R66.2
N$229: IC24.11(DETO) R57.2
N$236: C129.1 IC25.1(VIN) IC25.3(EN) IC26.1(VREF) L13.1
N$238: C119.1 C122.1 L16.1 L32.1 L33.1
N$265: C269.2 R168.2 R172.1
N$267: C114.1 R168.1 R169.1
N$271: C99.2 R45.1 R48.1(IN) R48.2(OUT) T1.6(OUT-)
N$272: C115.2 IC23.3(V+) L15.1
N$273: C104.1 C105.1 C106.1 C108.1 C111.1 IC24.7(VPLO) IC24.13(VPDT) IC24.18(VPRF) IC24.24(VPLO) L17.1
OUT+: C121.1 R58.1 R61.2
OUT-: C121.2 R59.1 R62.2
OUT_CM: C116.1 IC23.2(VOCM)
PORT1_CONVSTART: IC26.6(CONVST) ; also sheet 10
PORT1_SCLK: IC26.8(SCLK) ; also sheet 10
PORT1_SDO: IC26.7(SDO) ; also sheet 10
PORT1LO1: C269.1 ; also sheet 5
PORT1LO2: C98.1 ; also sheet 2
PORT1MIX1_EN: IC24.9(ENBL) ; also sheet 10
PORT1MIX2_EN: IC22.2(EN) IC23.7(SHDN) ; also sheet 10
PORT1SRC: C96.1 ; also sheet 4

### Notes on the sheet
- -3db pad | Return loss bridge | Downconverter to 1.IF (ca. 60MHz) | -10db pad
- 60MHz lowpass and conversion from
  250 Ohm to 28 Ohm impedance
- (28 Ohm impedance)
- Cut wire if attenuator placed
- P1db: 0dbm
- 1MS/s ADC
- Port 1
- Downconverter to 1.IF (ca. 250kHz) | Final IF amplifier and ADC driver | 300kHz lowpass

## Sheet 7 of 10: Port 2
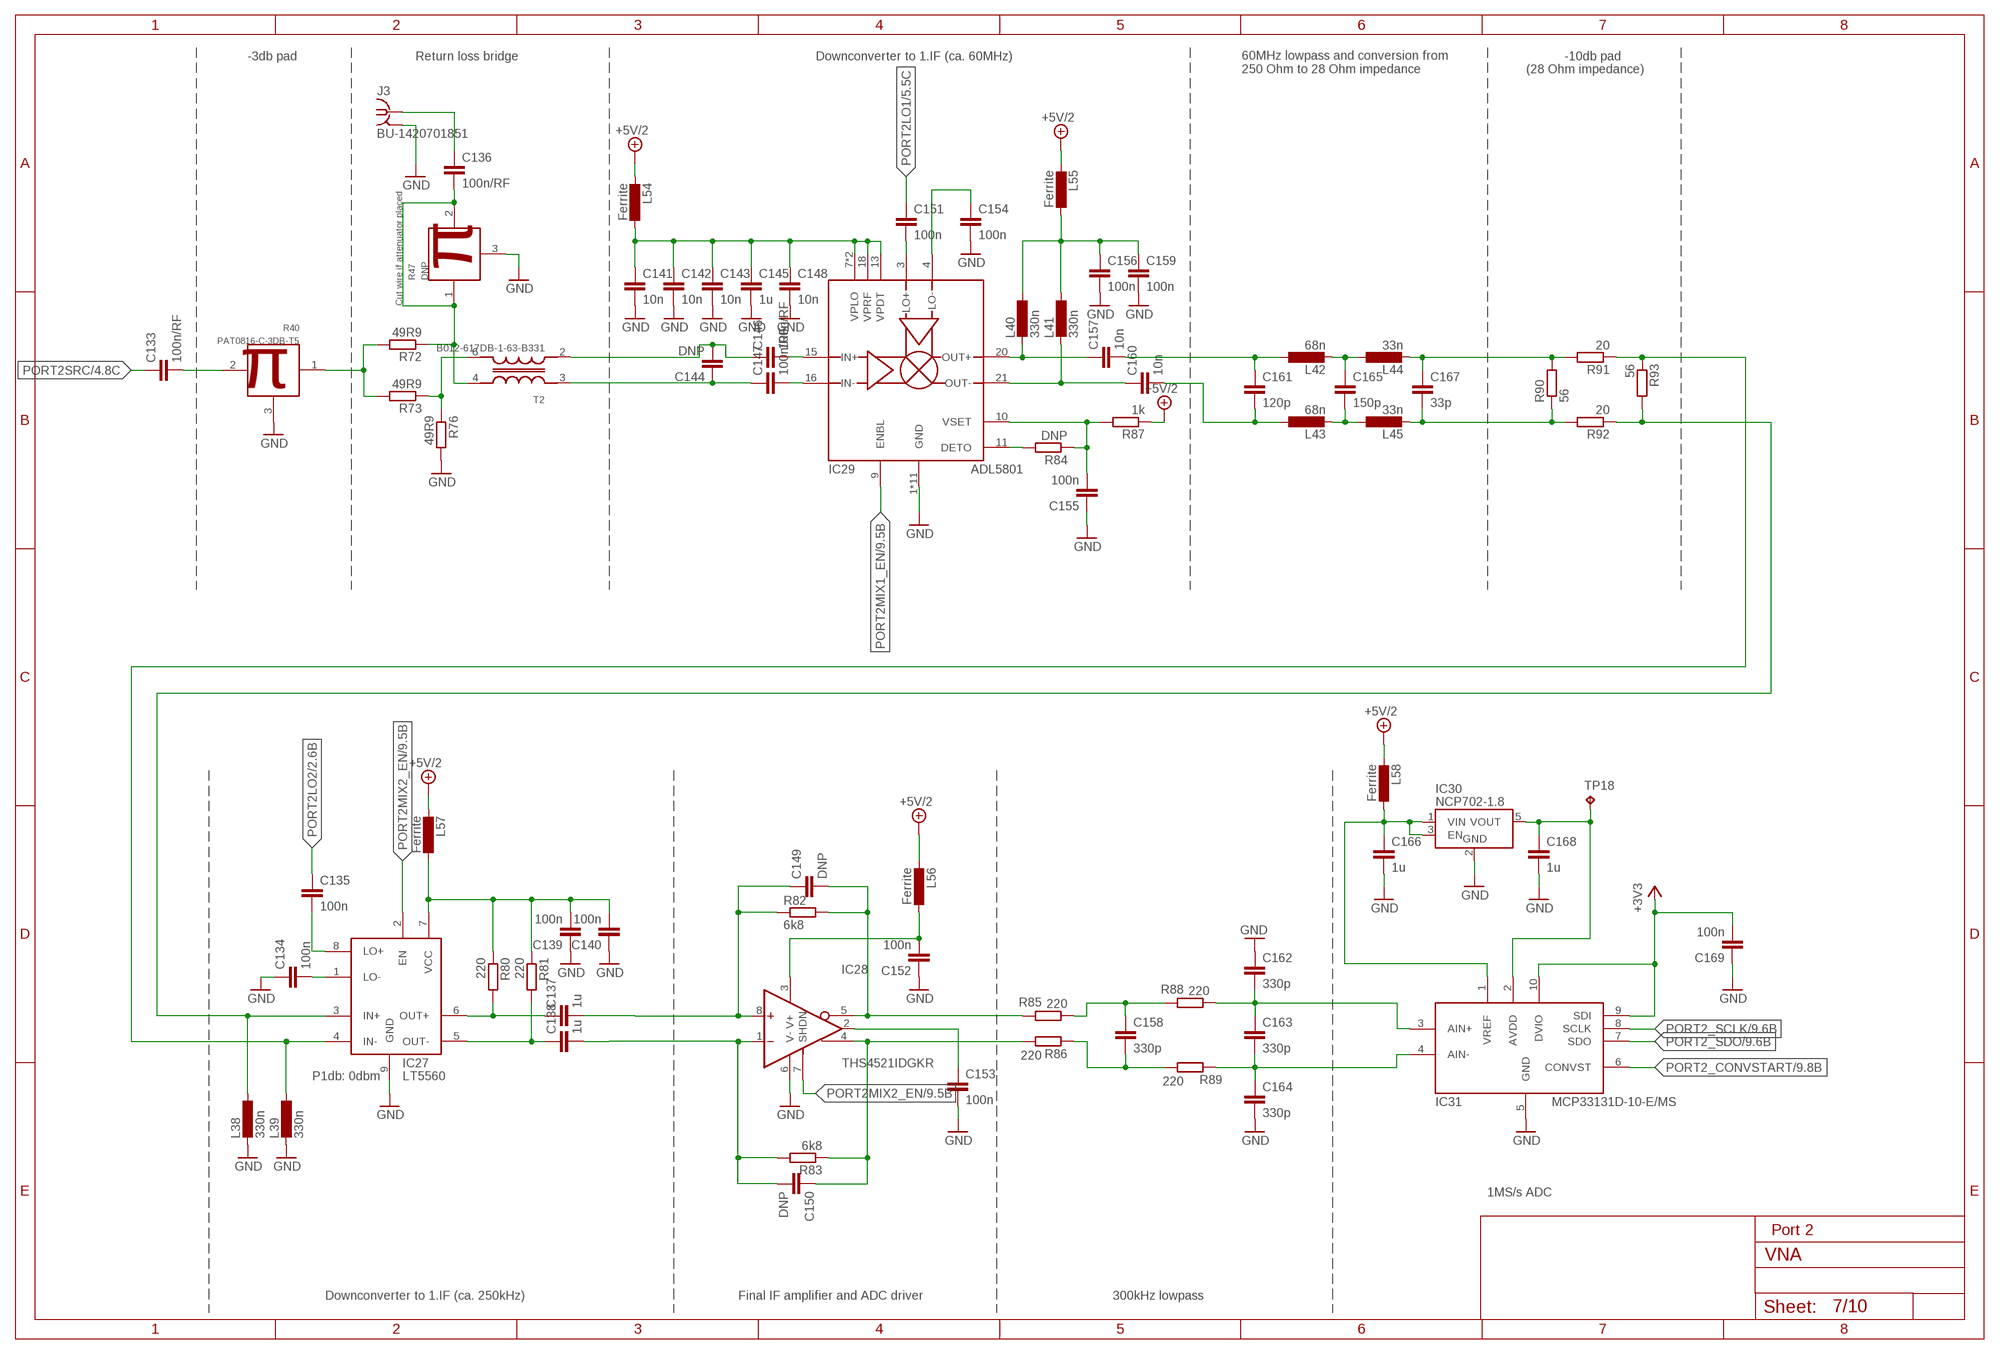
[diagram p6: schematic, sheet 7]

### Parts
C133  100n/RF  C-EUC0402:2  [C0402]
C134  100n  C-EUC0402:2  [C0402]
C135  100n  C-EUC0402:2  [C0402]
C136  100n/RF  C-EUC0402:2  [C0402]
C137  1u  C-EUC0402:2  [C0402]
C138  1u  C-EUC0402:2  [C0402]
C139  100n  C-EUC0402:2  [C0402]
C140  100n  C-EUC0402:2  [C0402]
C141  10n  C-EUC0402:2  [C0402]
C142  10n  C-EUC0402:2  [C0402]
C143  10n  C-EUC0402:2  [C0402]
C144  DNP  C-EUC0402:2  [C0402]
C145  1u  C-EUC0402:2  [C0402]
C146  100n/RF  C-EUC0402:2  [C0402]
C147  100n/RF  C-EUC0402:2  [C0402]
C148  10n  C-EUC0402:2  [C0402]
C149  DNP  C-EUC0402:2  [C0402]
C150  DNP  C-EUC0402:2  [C0402]
C151  100n  C-EUC0402:2  [C0402]
C152  100n  C-EUC0402:2  [C0402]
C153  100n  C-EUC0402:2  [C0402]
C154  100n  C-EUC0402:2  [C0402]
C155  100n  C-EUC0402:2  [C0402]
C156  100n  C-EUC0402:2  [C0402]
C157  10n  C-EUC0402:2  [C0402]
C158  330p  C-EUC0402:2  [C0402]
C159  100n  C-EUC0402:2  [C0402]
C160  10n  C-EUC0402:2  [C0402]
C161  120p  C-EUC0402:2  [C0402]
C162  330p  C-EUC0402:2  [C0402]
C163  330p  C-EUC0402:2  [C0402]
C164  330p  C-EUC0402:2  [C0402]
C165  150p  C-EUC0402:2  [C0402]
C166  1u  C-EUC0402:2  [C0402]
C167  33p  C-EUC0402:2  [C0402]
C168  1u  C-EUC0402:2  [C0402]
C169  100n  C-EUC0402:2  [C0402]
IC27  LT5560  [SON50P300X300X80-9T165X238]
IC28  THS4521IDGKR  [SOP65P490X110-8N]
IC29  ADL5801  [QFN50P400X400X100-25T250N]
IC30  NCP702-1.8  NCP702  [SOT95P240X110-5]
IC31  MCP33131D-10-E/MS  [SOP50P490X110-10N]
J3  BU-1420701851  [BU-1420701851]
L38  330n  INDUCTOR0402  [L0402]
L39  330n  INDUCTOR0402  [L0402]
L40  330n  INDUCTOR0402  [L0402]
L41  330n  INDUCTOR0402  [L0402]
L42  68n  INDUCTOR0402  [L0402]
L43  68n  INDUCTOR0402  [L0402]
L44  33n  INDUCTOR0402  [L0402]
L45  33n  INDUCTOR0402  [L0402]
L54  Ferrite  FERRITE  [R0402]
L55  Ferrite  FERRITE  [R0402]
L56  Ferrite  FERRITE  [R0402]
L57  Ferrite  FERRITE  [R0402]
L58  Ferrite  FERRITE  [R0402]
R40  PAT0816-C-3DB-T5  [PAT0816]
R47  DNP  PAT0816-C-3DB-T5  [PAT0816]
R72  49R9  R-EU_R0402  [R0402]
R73  49R9  R-EU_R0402  [R0402]
R76  49R9  R-EU_R0402  [R0402]
R80  220  R-EU_R0402  [R0402]
R81  220  R-EU_R0402  [R0402]
R82  6k8  R-EU_R0402  [R0402]
R83  6k8  R-EU_R0402  [R0402]
R84  DNP  R-EU_R0402  [R0402]
R85  220  R-EU_R0402  [R0402]
R86  220  R-EU_R0402  [R0402]
R87  1k  R-EU_R0402  [R0402]
R88  220  R-EU_R0402  [R0402]
R89  220  R-EU_R0402  [R0402]
R90  56  R-EU_R0402  [R0402]
R91  20  R-EU_R0402  [R0402]
R92  20  R-EU_R0402  [R0402]
R93  56  R-EU_R0402  [R0402]
T2  B012-617DB-1-63-B331  [EASTEVER_BALUN]
TP18  TPB1,27  [B1,27]

### Nets
+3V3: C169.2 IC31.9(SDI) IC31.10(DVIO) ; also sheet 1,2,3,4,5,6,8,9,10
+5V/2: L54.2 L55.2 L56.2 L57.2 L58.2 R87.1 ; also sheet 1
GND: C134.1 C139.1 C140.1 C141.2 C142.2 C143.2 C145.2 C148.2 C152.1 C153.2 C154.2 C155.1 C156.2 C159.2 C162.1 C164.2 C166.2 C168.2 C169.1 IC27.9(GND) IC28.6(V-) IC29.1(GND) IC29.2(GND) IC29.5(GND) IC29.6(GND) IC29.8(GND) IC29.12(GND) IC29.14(GND) IC29.17(GND) IC29.19(GND) IC29.23(GND) IC29.25(GND) IC30.2(GND) IC31.5(GND) J3.G@1 J3.G@2 J3.G@3 J3.G@4 L38.2 L39.2 R40.3(GND) R47.3(GND) R76.2 ; also sheet 1,2,3,4,5,6,8,9,10
N$4: C136.2 R47.1(IN) R47.2(OUT) R72.1 T2.4(OUT+)
N$21: C133.2 R40.2(OUT)
N$22: R40.1(IN) R72.2 R73.2
N$23: IC27.3(IN+) L38.1 R92.1 R93.2
N$26: R73.1 R76.1 T2.6(OUT-)
N$29: C146.2 IC29.15(IN+)
N$30: C147.2 IC29.16(IN-)
N$35: C144.1 C147.1 T2.3(IN+)
N$36: C144.2 C146.1 T2.2(IN-)
N$37: C154.1 IC29.4(LO-)
N$38: C151.2 IC29.3(LO+)
N$39: C157.1 IC29.20(OUT+) L40.2
N$40: C160.1 IC29.21(OUT-) L41.2
N$41: C155.2 IC29.10(VSET) R84.1 R87.2
N$42: C134.2 IC27.1(LO-)
N$43: C137.1 IC27.6(OUT+) R80.2
N$44: C138.1 IC27.5(OUT-) R81.2
N$45: C150.1 IC28.4(+OUT) R83.1 R86.2
N$46: C149.2 IC28.5(-OUT) R82.2 R85.2
N$47: C157.2 C161.1 L42.1
N$48: C160.2 C161.2 L43.1
N$49: C165.2 L43.2 L45.1
N$50: C165.1 L42.2 L44.1
N$52: C135.2 IC27.8(LO+)
N$53: C162.2 C163.1 IC31.3(AIN+) R88.1
N$54: C163.2 C164.1 IC31.4(AIN-) R89.1
N$55: C167.1 L44.2 R90.2 R91.2
N$56: C167.2 L45.2 R90.1 R92.2
N$58: C138.2 C150.2 IC28.1(-IN) R83.2
N$59: C137.2 C149.1 IC28.8(+IN) R82.1
N$204: C168.1 IC30.5(VOUT) IC31.2(AVDD) TP18.TP
N$223: IC27.4(IN-) L39.1 R91.1 R93.1
N$230: IC29.11(DETO) R84.2
N$239: C136.1 J3.1
N$274: C141.1 C142.1 C143.1 C145.1 C148.1 IC29.7(VPLO) IC29.13(VPDT) IC29.18(VPRF) IC29.24(VPLO) L54.1
N$275: C156.1 C159.1 L40.1 L41.1 L55.1
N$276: C152.2 IC28.3(V+) L56.1
N$277: C139.2 C140.2 IC27.7(VCC) L57.1 R80.1 R81.1
N$278: C166.1 IC30.1(VIN) IC30.3(EN) IC31.1(VREF) L58.1
OUT+1: C158.1 R85.1 R88.2
OUT-1: C158.2 R86.1 R89.2
OUT_CM1: C153.1 IC28.2(VOCM)
PORT2_CONVSTART: IC31.6(CONVST) ; also sheet 9
PORT2_SCLK: IC31.8(SCLK) ; also sheet 9
PORT2_SDO: IC31.7(SDO) ; also sheet 9
PORT2LO1: C151.1 ; also sheet 5
PORT2LO2: C135.1 ; also sheet 2
PORT2MIX1_EN: IC29.9(ENBL) ; also sheet 9
PORT2MIX2_EN: IC27.2(EN) IC28.7(SHDN) ; also sheet 9
PORT2SRC: C133.1 ; also sheet 4

### Notes on the sheet
- -3db pad | Return loss bridge | Downconverter to 1.IF (ca. 60MHz) | -10db pad
- 60MHz lowpass and conversion from
  250 Ohm to 28 Ohm impedance
- (28 Ohm impedance)
- Cut wire if attenuator placed
- P1db: 0dbm
- 1MS/s ADC
- Port 2
- Downconverter to 1.IF (ca. 250kHz) | Final IF amplifier and ADC driver | 300kHz lowpass

## Sheet 8 of 10: Ref Signal
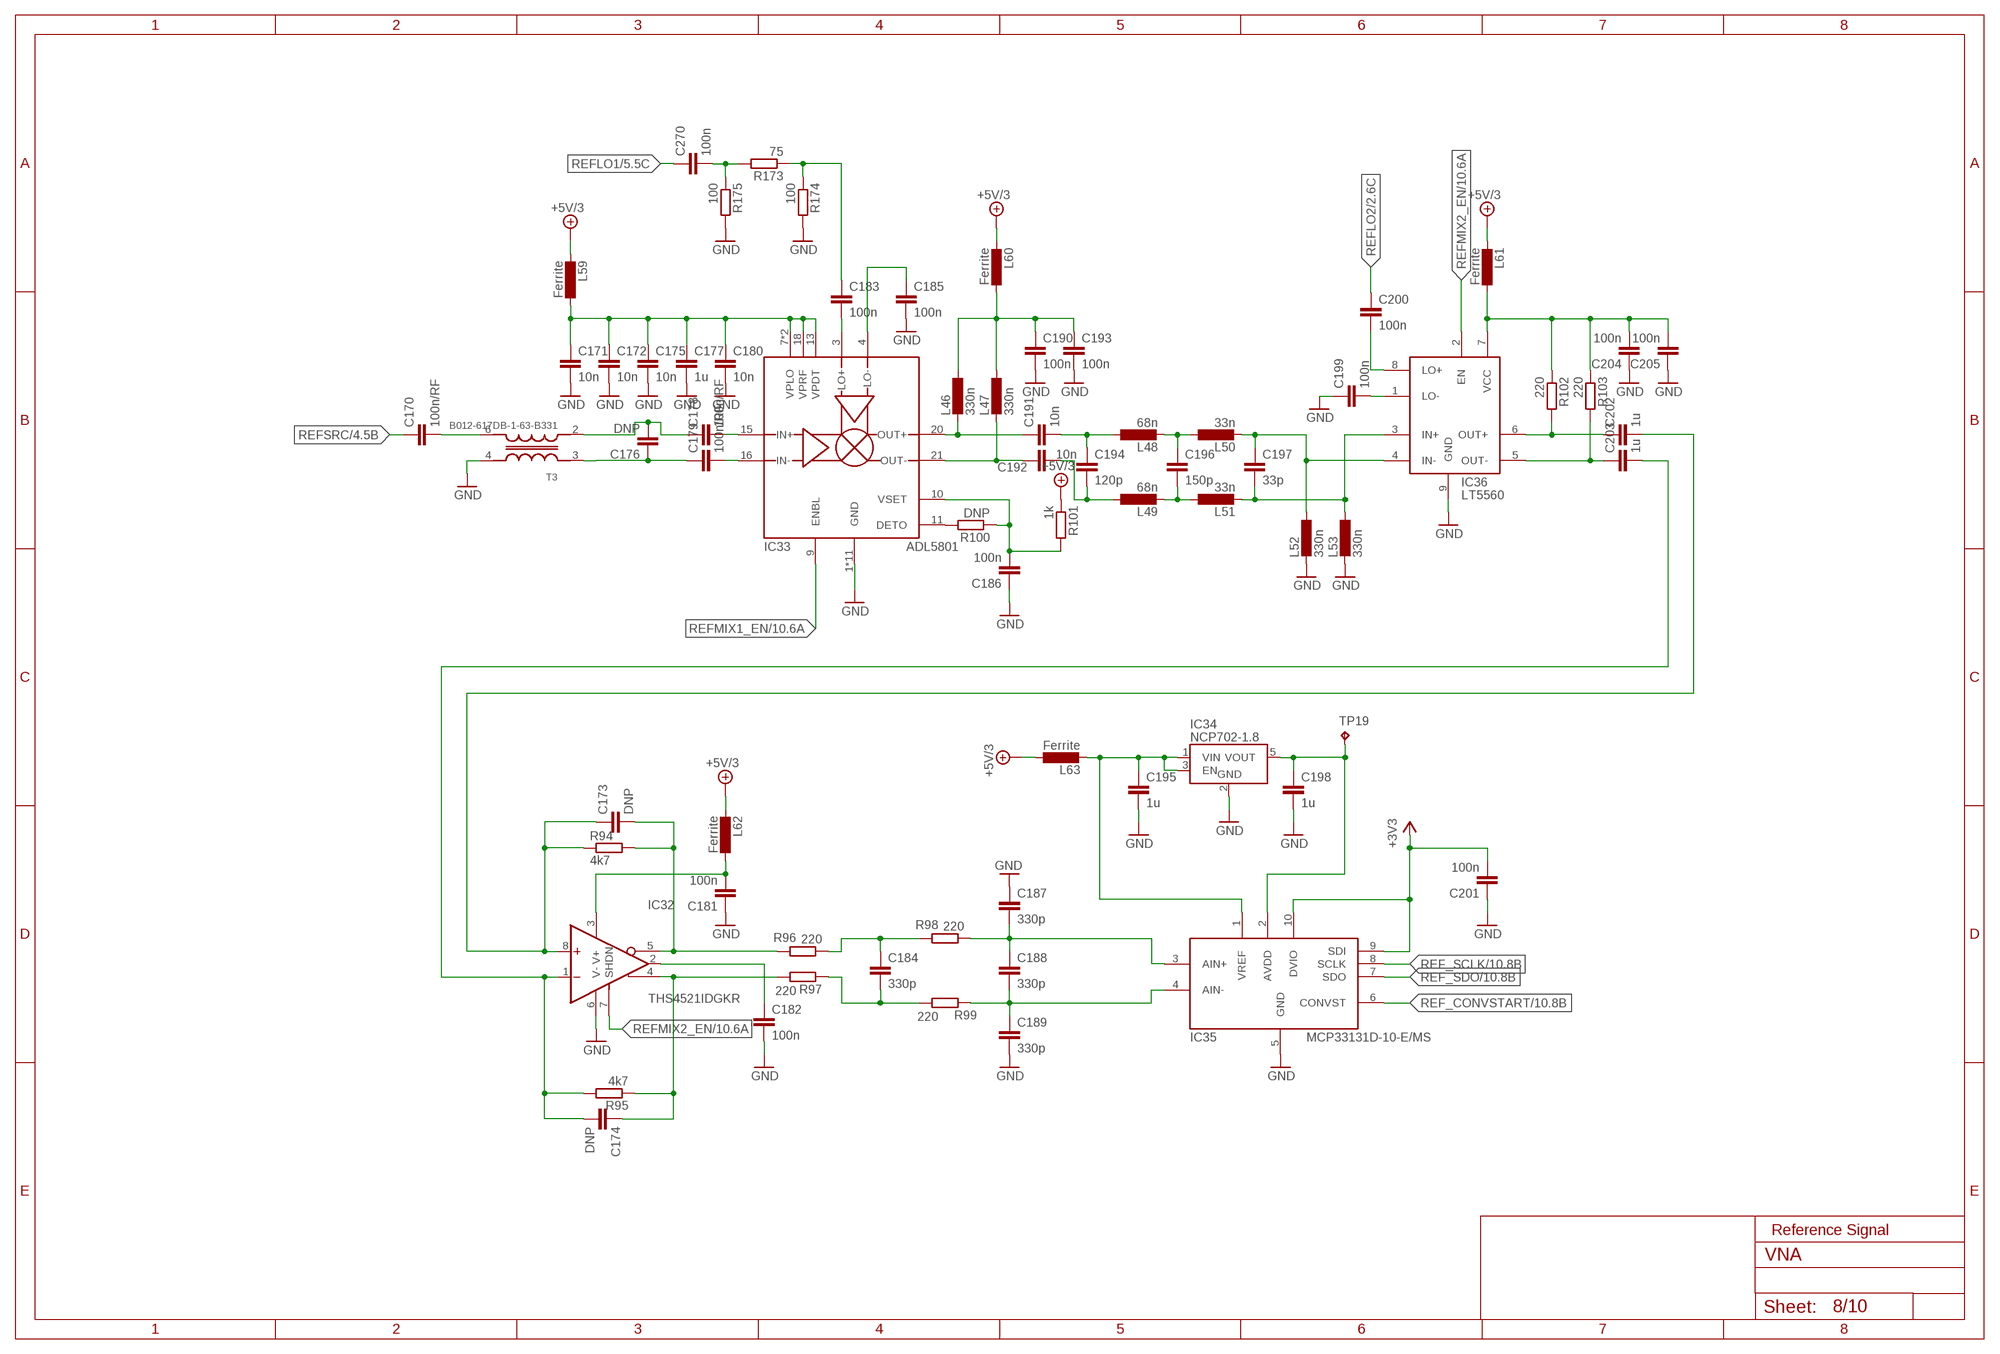
[diagram p7: schematic, sheet 8]

### Parts
C170  100n/RF  C-EUC0402:2  [C0402]
C171  10n  C-EUC0402:2  [C0402]
C172  10n  C-EUC0402:2  [C0402]
C173  DNP  C-EUC0402:2  [C0402]
C174  DNP  C-EUC0402:2  [C0402]
C175  10n  C-EUC0402:2  [C0402]
C176  DNP  C-EUC0402:2  [C0402]
C177  1u  C-EUC0402:2  [C0402]
C178  100n/RF  C-EUC0402:2  [C0402]
C179  100n/RF  C-EUC0402:2  [C0402]
C180  10n  C-EUC0402:2  [C0402]
C181  100n  C-EUC0402:2  [C0402]
C182  100n  C-EUC0402:2  [C0402]
C183  100n  C-EUC0402:2  [C0402]
C184  330p  C-EUC0402:2  [C0402]
C185  100n  C-EUC0402:2  [C0402]
C186  100n  C-EUC0402:2  [C0402]
C187  330p  C-EUC0402:2  [C0402]
C188  330p  C-EUC0402:2  [C0402]
C189  330p  C-EUC0402:2  [C0402]
C190  100n  C-EUC0402:2  [C0402]
C191  10n  C-EUC0402:2  [C0402]
C192  10n  C-EUC0402:2  [C0402]
C193  100n  C-EUC0402:2  [C0402]
C194  120p  C-EUC0402:2  [C0402]
C195  1u  C-EUC0402:2  [C0402]
C196  150p  C-EUC0402:2  [C0402]
C197  33p  C-EUC0402:2  [C0402]
C198  1u  C-EUC0402:2  [C0402]
C199  100n  C-EUC0402:2  [C0402]
C200  100n  C-EUC0402:2  [C0402]
C201  100n  C-EUC0402:2  [C0402]
C202  1u  C-EUC0402:2  [C0402]
C203  1u  C-EUC0402:2  [C0402]
C204  100n  C-EUC0402:2  [C0402]
C205  100n  C-EUC0402:2  [C0402]
C270  100n  C-EUC0402:2  [C0402]
IC32  THS4521IDGKR  [SOP65P490X110-8N]
IC33  ADL5801  [QFN50P400X400X100-25T250N]
IC34  NCP702-1.8  NCP702  [SOT95P240X110-5]
IC35  MCP33131D-10-E/MS  [SOP50P490X110-10N]
IC36  LT5560  [SON50P300X300X80-9T165X238]
L46  330n  INDUCTOR0402  [L0402]
L47  330n  INDUCTOR0402  [L0402]
L48  68n  INDUCTOR0402  [L0402]
L49  68n  INDUCTOR0402  [L0402]
L50  33n  INDUCTOR0402  [L0402]
L51  33n  INDUCTOR0402  [L0402]
L52  330n  INDUCTOR0402  [L0402]
L53  330n  INDUCTOR0402  [L0402]
L59  Ferrite  FERRITE  [R0402]
L60  Ferrite  FERRITE  [R0402]
L61  Ferrite  FERRITE  [R0402]
L62  Ferrite  FERRITE  [R0402]
L63  Ferrite  FERRITE  [R0402]
R94  4k7  R-EU_R0402  [R0402]
R95  4k7  R-EU_R0402  [R0402]
R96  220  R-EU_R0402  [R0402]
R97  220  R-EU_R0402  [R0402]
R98  220  R-EU_R0402  [R0402]
R99  220  R-EU_R0402  [R0402]
R100  DNP  R-EU_R0402  [R0402]
R101  1k  R-EU_R0402  [R0402]
R102  220  R-EU_R0402  [R0402]
R103  220  R-EU_R0402  [R0402]
R173  75  R-EU_R0402  [R0402]
R174  100  R-EU_R0402  [R0402]
R175  100  R-EU_R0402  [R0402]
T3  B012-617DB-1-63-B331  [EASTEVER_BALUN]
TP19  TPB1,27  [B1,27]

### Nets
+3V3: C201.2 IC35.9(SDI) IC35.10(DVIO) ; also sheet 1,2,3,4,5,6,7,9,10
+5V/3: L59.2 L60.2 L61.2 L62.2 L63.1 R101.1 ; also sheet 1
GND: C171.2 C172.2 C175.2 C177.2 C180.2 C181.1 C182.2 C185.2 C186.1 C187.1 C189.2 C190.2 C193.2 C195.2 C198.2 C199.1 C201.1 C204.1 C205.1 IC32.6(V-) IC33.1(GND) IC33.2(GND) IC33.5(GND) IC33.6(GND) IC33.8(GND) IC33.12(GND) IC33.14(GND) IC33.17(GND) IC33.19(GND) IC33.23(GND) IC33.25(GND) IC34.2(GND) IC35.5(GND) IC36.9(GND) L52.2 L53.2 R174.2 R175.2 T3.4(OUT+) ; also sheet 1,2,3,4,5,6,7,9,10
N$61: C170.2 T3.6(OUT-)
N$66: C178.2 IC33.15(IN+)
N$67: C179.2 IC33.16(IN-)
N$68: C176.1 C179.1 T3.3(IN+)
N$69: C176.2 C178.1 T3.2(IN-)
N$70: C185.1 IC33.4(LO-)
N$71: C183.2 IC33.3(LO+)
N$72: C191.1 IC33.20(OUT+) L46.2
N$73: C192.1 IC33.21(OUT-) L47.2
N$74: C186.2 IC33.10(VSET) R100.1 R101.2
N$75: C199.2 IC36.1(LO-)
N$76: C202.1 IC36.6(OUT+) R102.2
N$77: C203.1 IC36.5(OUT-) R103.2
N$78: C173.1 C202.2 IC32.8(+IN) R94.1
N$79: C174.2 C203.2 IC32.1(-IN) R95.2
N$80: C174.1 IC32.4(+OUT) R95.1 R97.2
N$81: C173.2 IC32.5(-OUT) R94.2 R96.2
N$82: C191.2 C194.1 L48.1
N$83: C192.2 C194.2 L49.1
N$84: C196.2 L49.2 L51.1
N$85: C196.1 L48.2 L50.1
N$86: C197.1 IC36.4(IN-) L50.2 L52.1
N$87: C197.2 IC36.3(IN+) L51.2 L53.1
N$88: C200.2 IC36.8(LO+)
N$89: C187.2 C188.1 IC35.3(AIN+) R98.1
N$90: C188.2 C189.1 IC35.4(AIN-) R99.1
N$205: C198.1 IC34.5(VOUT) IC35.2(AVDD) TP19.TP
N$231: IC33.11(DETO) R100.2
N$268: C270.2 R173.2 R175.1
N$269: C183.1 R173.1 R174.1
N$279: C171.1 C172.1 C175.1 C177.1 C180.1 IC33.7(VPLO) IC33.13(VPDT) IC33.18(VPRF) IC33.24(VPLO) L59.1
N$280: C190.1 C193.1 L46.1 L47.1 L60.1
N$281: C204.2 C205.2 IC36.7(VCC) L61.1 R102.1 R103.1
N$282: C181.2 IC32.3(V+) L62.1
N$283: C195.1 IC34.1(VIN) IC34.3(EN) IC35.1(VREF) L63.2
OUT+2: C184.1 R96.1 R98.2
OUT-2: C184.2 R97.1 R99.2
OUT_CM2: C182.1 IC32.2(VOCM)
REF_CONVSTART: IC35.6(CONVST) ; also sheet 10
REF_SCLK: IC35.8(SCLK) ; also sheet 10
REF_SDO: IC35.7(SDO) ; also sheet 10
REFLO1: C270.1 ; also sheet 5
REFLO2: C200.1 ; also sheet 2
REFMIX1_EN: IC33.9(ENBL) ; also sheet 10
REFMIX2_EN: IC32.7(SHDN) IC36.2(EN) ; also sheet 10
REFSRC: C170.1 ; also sheet 4

### Notes on the sheet
- Reference Signal

## Sheet 9 of 10
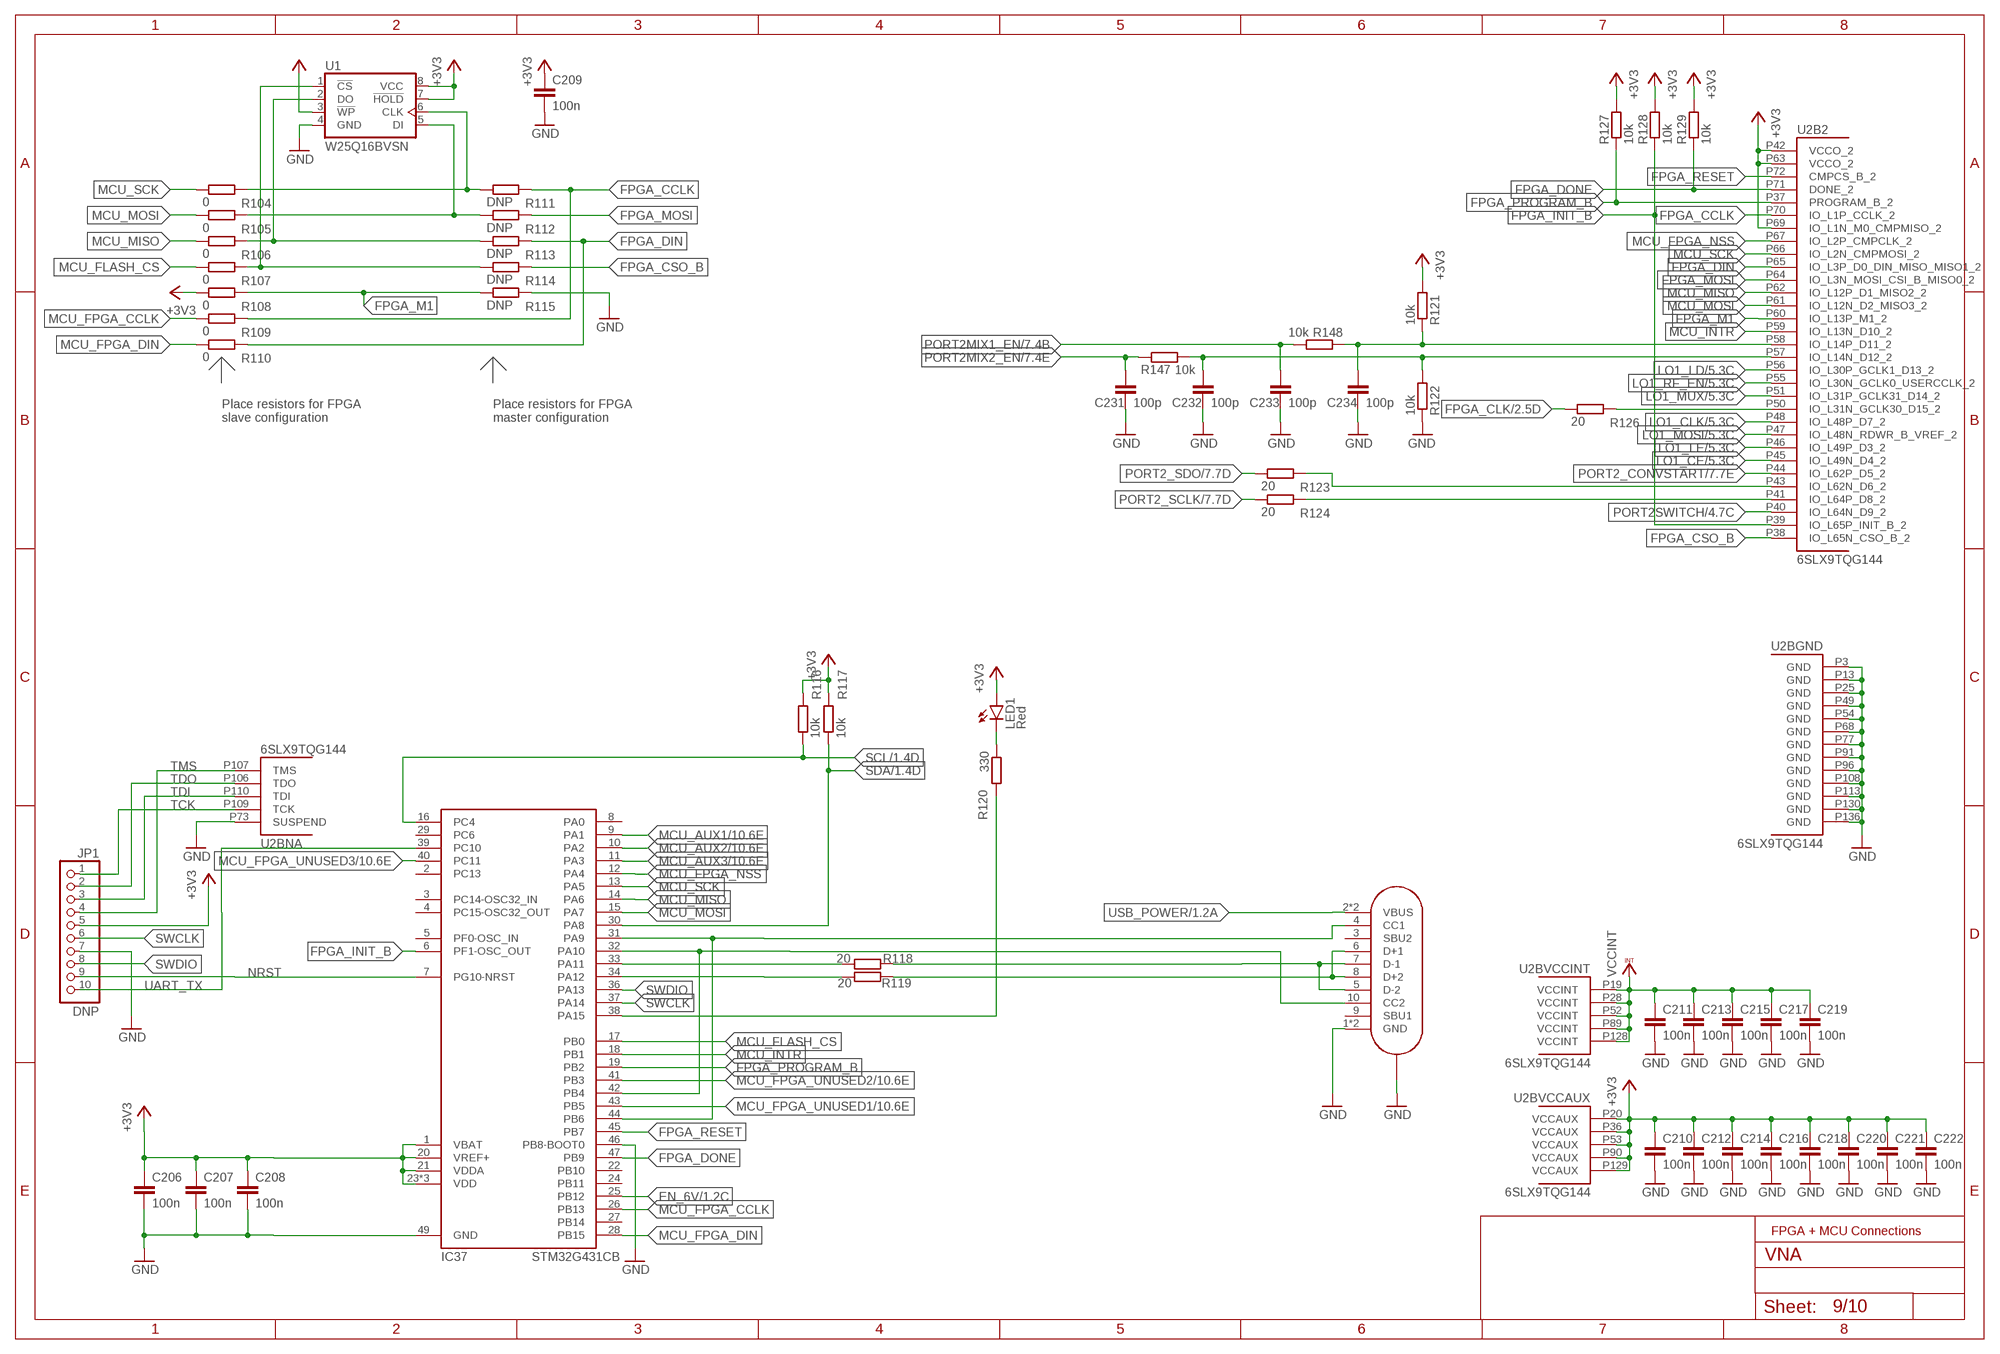
[diagram p8: schematic, sheet 9]

### Parts
C206  100n  C-EUC0402:2  [C0402]
C207  100n  C-EUC0402:2  [C0402]
C208  100n  C-EUC0402:2  [C0402]
C209  100n  C-EUC0402:2  [C0402]
C210  100n  C-EUC0402:2  [C0402]
C211  100n  C-EUC0402:2  [C0402]
C212  100n  C-EUC0402:2  [C0402]
C213  100n  C-EUC0402:2  [C0402]
C214  100n  C-EUC0402:2  [C0402]
C215  100n  C-EUC0402:2  [C0402]
C216  100n  C-EUC0402:2  [C0402]
C217  100n  C-EUC0402:2  [C0402]
C218  100n  C-EUC0402:2  [C0402]
C219  100n  C-EUC0402:2  [C0402]
C220  100n  C-EUC0402:2  [C0402]
C221  100n  C-EUC0402:2  [C0402]
C222  100n  C-EUC0402:2  [C0402]
C231  100p  C-EUC0402:2  [C0402]
C232  100p  C-EUC0402:2  [C0402]
C233  100p  C-EUC0402:2  [C0402]
C234  100p  C-EUC0402:2  [C0402]
IC37  STM32G431CB  [QFN50P700X700X60-49T560N]
J4  TYPE-C16P(073)  [TYPE-C16P]
JP1  DNP  PINHD-1X10/90  [1X10/90]
LED1  Red  LEDCHIPLED_0603  [CHIPLED_0603]
R104  0  R-EU_R0402  [R0402]
R105  0  R-EU_R0402  [R0402]
R106  0  R-EU_R0402  [R0402]
R107  0  R-EU_R0402  [R0402]
R108  0  R-EU_R0402  [R0402]
R109  0  R-EU_R0402  [R0402]
R110  0  R-EU_R0402  [R0402]
R111  DNP  R-EU_R0402  [R0402]
R112  DNP  R-EU_R0402  [R0402]
R113  DNP  R-EU_R0402  [R0402]
R114  DNP  R-EU_R0402  [R0402]
R115  DNP  R-EU_R0402  [R0402]
R116  10k  R-EU_R0402  [R0402]
R117  10k  R-EU_R0402  [R0402]
R118  20  R-EU_R0402  [R0402]
R119  20  R-EU_R0402  [R0402]
R120  330  R-EU_R0402  [R0402]
R121  10k  R-EU_R0402  [R0402]
R122  10k  R-EU_R0402  [R0402]
R123  20  R-EU_R0402  [R0402]
R124  20  R-EU_R0402  [R0402]
R126  20  R-EU_R0402  [R0402]
R127  10k  R-EU_R0402  [R0402]
R128  10k  R-EU_R0402  [R0402]
R129  10k  R-EU_R0402  [R0402]
R147  10k  R-EU_R0402  [R0402]
R148  10k  R-EU_R0402  [R0402]
U1  W25Q16BVSN  [SO08]
U2  6SLX9TQG144  [TQ144]

### Nets
+3V3: C206.1 C207.1 C208.1 C209.1 C210.1 C212.1 C214.1 C216.1 C218.1 C220.1 C221.1 C222.1 IC37.1(VBAT) IC37.20(VREF+) IC37.21(VDDA) IC37.23(VDD) IC37.35(VDD) IC37.48(VDD) JP1.5 LED1.A R108.1 R116.2 R117.2 R121.2 R127.2 R128.2 R129.2 U1.3(!WP!) U1.7(!HOLD!) U1.8(VCC) U2.P20(BVCCAUX:VCCAUX) U2.P36(BVCCAUX:VCCAUX) U2.P42(B2:VCCO_2) U2.P53(BVCCAUX:VCCAUX) U2.P63(B2:VCCO_2) U2.P69(B2:IO_L1N_M0_CMPMISO_2) U2.P90(BVCCAUX:VCCAUX) U2.P129(BVCCAUX:VCCAUX) ; also sheet 1,2,3,4,5,6,7,8,10
EN_6V: IC37.25(PB12) ; also sheet 1
FPGA_CCLK: R109.2 R111.2 U2.P70(B2:IO_L1P_CCLK_2)
FPGA_CLK: R126.1 ; also sheet 2
FPGA_CSO_B: R114.2 U2.P38(B2:IO_L65N_CSO_B_2)
FPGA_DIN: R110.2 R113.2 U2.P65(B2:IO_L3P_D0_DIN_MISO_MISO1_2)
FPGA_DONE: IC37.47(PB9) R129.1 U2.P71(B2:DONE_2)
FPGA_INIT_B: IC37.6(PF1-OSC_OUT) R128.1 U2.P39(B2:IO_L65P_INIT_B_2)
FPGA_M1: R108.2 R115.1 U2.P60(B2:IO_L13P_M1_2)
FPGA_MOSI: R112.2 U2.P64(B2:IO_L3N_MOSI_CSI_B_MISO0_2)
FPGA_PROGRAM_B: IC37.19(PB2) R127.1 U2.P37(B2:PROGRAM_B_2)
FPGA_RESET: IC37.45(PB7) U2.P72(B2:CMPCS_B_2)
GND: C206.2 C207.2 C208.2 C209.2 C210.2 C211.2 C212.2 C213.2 C214.2 C215.2 C216.2 C217.2 C218.2 C219.2 C220.2 C221.2 C222.2 C231.2 C232.2 C233.2 C234.2 IC37.46(PB8-BOOT0) IC37.49(GND) J4.1(GND) J4.12(GND) J4.M1(CASE) J4.M2(CASE) J4.M3(CASE) J4.M4(CASE) JP1.7 R115.2 R122.1 U1.4(GND) U2.P3(BGND:GND) U2.P13(BGND:GND) U2.P25(BGND:GND) U2.P49(BGND:GND) U2.P54(BGND:GND) U2.P68(BGND:GND) U2.P73(BNA:SUSPEND) U2.P77(BGND:GND) U2.P91(BGND:GND) U2.P96(BGND:GND) U2.P108(BGND:GND) U2.P113(BGND:GND) U2.P130(BGND:GND) U2.P136(BGND:GND) ; also sheet 1,2,3,4,5,6,7,8,10
LO1_CE: U2.P45(B2:IO_L49N_D4_2) ; also sheet 5
LO1_CLK: U2.P48(B2:IO_L48P_D7_2) ; also sheet 5
LO1_LD: U2.P56(B2:IO_L30P_GCLK1_D13_2) ; also sheet 5
LO1_LE: U2.P46(B2:IO_L49P_D3_2) ; also sheet 5
LO1_MOSI: U2.P47(B2:IO_L48N_RDWR_B_VREF_2) ; also sheet 5
LO1_MUX: U2.P51(B2:IO_L31P_GCLK31_D14_2) ; also sheet 5
LO1_RF_EN: U2.P55(B2:IO_L30N_GCLK0_USERCCLK_2) ; also sheet 5
MCU_AUX1: IC37.9(PA1) ; also sheet 10
MCU_AUX2: IC37.10(PA2) ; also sheet 10
MCU_AUX3: IC37.11(PA3) ; also sheet 10
MCU_FLASH_CS: IC37.17(PB0) R107.1
MCU_FPGA_CCLK: IC37.26(PB13) R109.1
MCU_FPGA_DIN: IC37.28(PB15) R110.1
MCU_FPGA_NSS: IC37.12(PA4) U2.P67(B2:IO_L2P_CMPCLK_2)
MCU_FPGA_UNUSED1: IC37.43(PB5) ; also sheet 10
MCU_FPGA_UNUSED2: IC37.41(PB3) ; also sheet 10
MCU_FPGA_UNUSED3: IC37.40(PC11) ; also sheet 10
MCU_INTR: IC37.18(PB1) U2.P59(B2:IO_L13N_D10_2)
MCU_MISO: IC37.14(PA6) R106.1 U2.P62(B2:IO_L12P_D1_MISO2_2)
MCU_MOSI: IC37.15(PA7) R105.1 U2.P61(B2:IO_L12N_D2_MISO3_2)
MCU_SCK: IC37.13(PA5) R104.1 U2.P66(B2:IO_L2N_CMPMOSI_2)
N$172: C232.1 R122.2 R147.1 U2.P57(B2:IO_L14N_D12_2)
N$186: J4.6(D+1) J4.8(D+2) R119.2
N$187: IC37.33(PA11) R118.2
N$188: IC37.34(PA12) R119.1
N$189: J4.5(D-2) J4.7(D-1) R118.1
N$190: LED1.C R120.1
N$191: IC37.38(PA15) R120.2
N$197: R104.2 R111.1 U1.6(CLK)
N$198: R126.2 U2.P50(B2:IO_L31N_GCLK30_D15_2)
N$224: R124.2 U2.P41(B2:IO_L64P_D8_2)
N$228: R123.2 U2.P43(B2:IO_L62N_D6_2)
N$233: IC37.31(PA9) IC37.44(PB6) J4.4(CC1)
N$234: IC37.32(PA10) IC37.42(PB4) J4.10(CC2)
N$237: R105.2 R112.1 U1.5(DI)
N$240: R106.2 R113.1 U1.2(DO)
N$241: R107.2 R114.1 U1.1(!CS!)
N$512: C234.1 R121.1 R148.2 U2.P58(B2:IO_L14P_D11_2)
NRST: IC37.7(PG10-NRST) JP1.9
PORT2_CONVSTART: U2.P44(B2:IO_L62P_D5_2) ; also sheet 7
PORT2_SCLK: R124.1 ; also sheet 7
PORT2_SDO: R123.1 ; also sheet 7
PORT2MIX1_EN: C233.1 R148.1 ; also sheet 7
PORT2MIX2_EN: C231.1 R147.2 ; also sheet 7
PORT2SWITCH: U2.P40(B2:IO_L64N_D9_2) ; also sheet 4
SCL: IC37.16(PC4) R116.1 ; also sheet 1,2
SDA: IC37.30(PA8) R117.1 ; also sheet 1,2
SWCLK: IC37.37(PA14) JP1.6
SWDIO: IC37.36(PA13) JP1.8
TCK: JP1.1 U2.P109(BNA:TCK)
TDI: JP1.3 U2.P110(BNA:TDI)
TDO: JP1.2 U2.P106(BNA:TDO)
TMS: JP1.4 U2.P107(BNA:TMS)
UART_TX: IC37.39(PC10) JP1.10
USB_POWER: J4.2(VBUS) J4.11(VBUS) ; also sheet 1
VCCINT: C211.1 C213.1 C215.1 C217.1 C219.1 U2.P19(BVCCINT:VCCINT) U2.P28(BVCCINT:VCCINT) U2.P52(BVCCINT:VCCINT) U2.P89(BVCCINT:VCCINT) U2.P128(BVCCINT:VCCINT) ; also sheet 1
Unconnected: IC37.2(PC13) IC37.3(PC14-OSC32_IN) IC37.4(PC15-OSC32_OUT) IC37.5(PF0-OSC_IN) IC37.8(PA0) IC37.22(PB10) IC37.24(PB11) IC37.27(PB14) IC37.29(PC6) J4.3(SBU2) J4.9(SBU1)

### Notes on the sheet
- Place resistors for FPGA
  slave configuration
- Place resistors for FPGA
  master configuration
- FPGA + MCU Connections

## Sheet 10 of 10
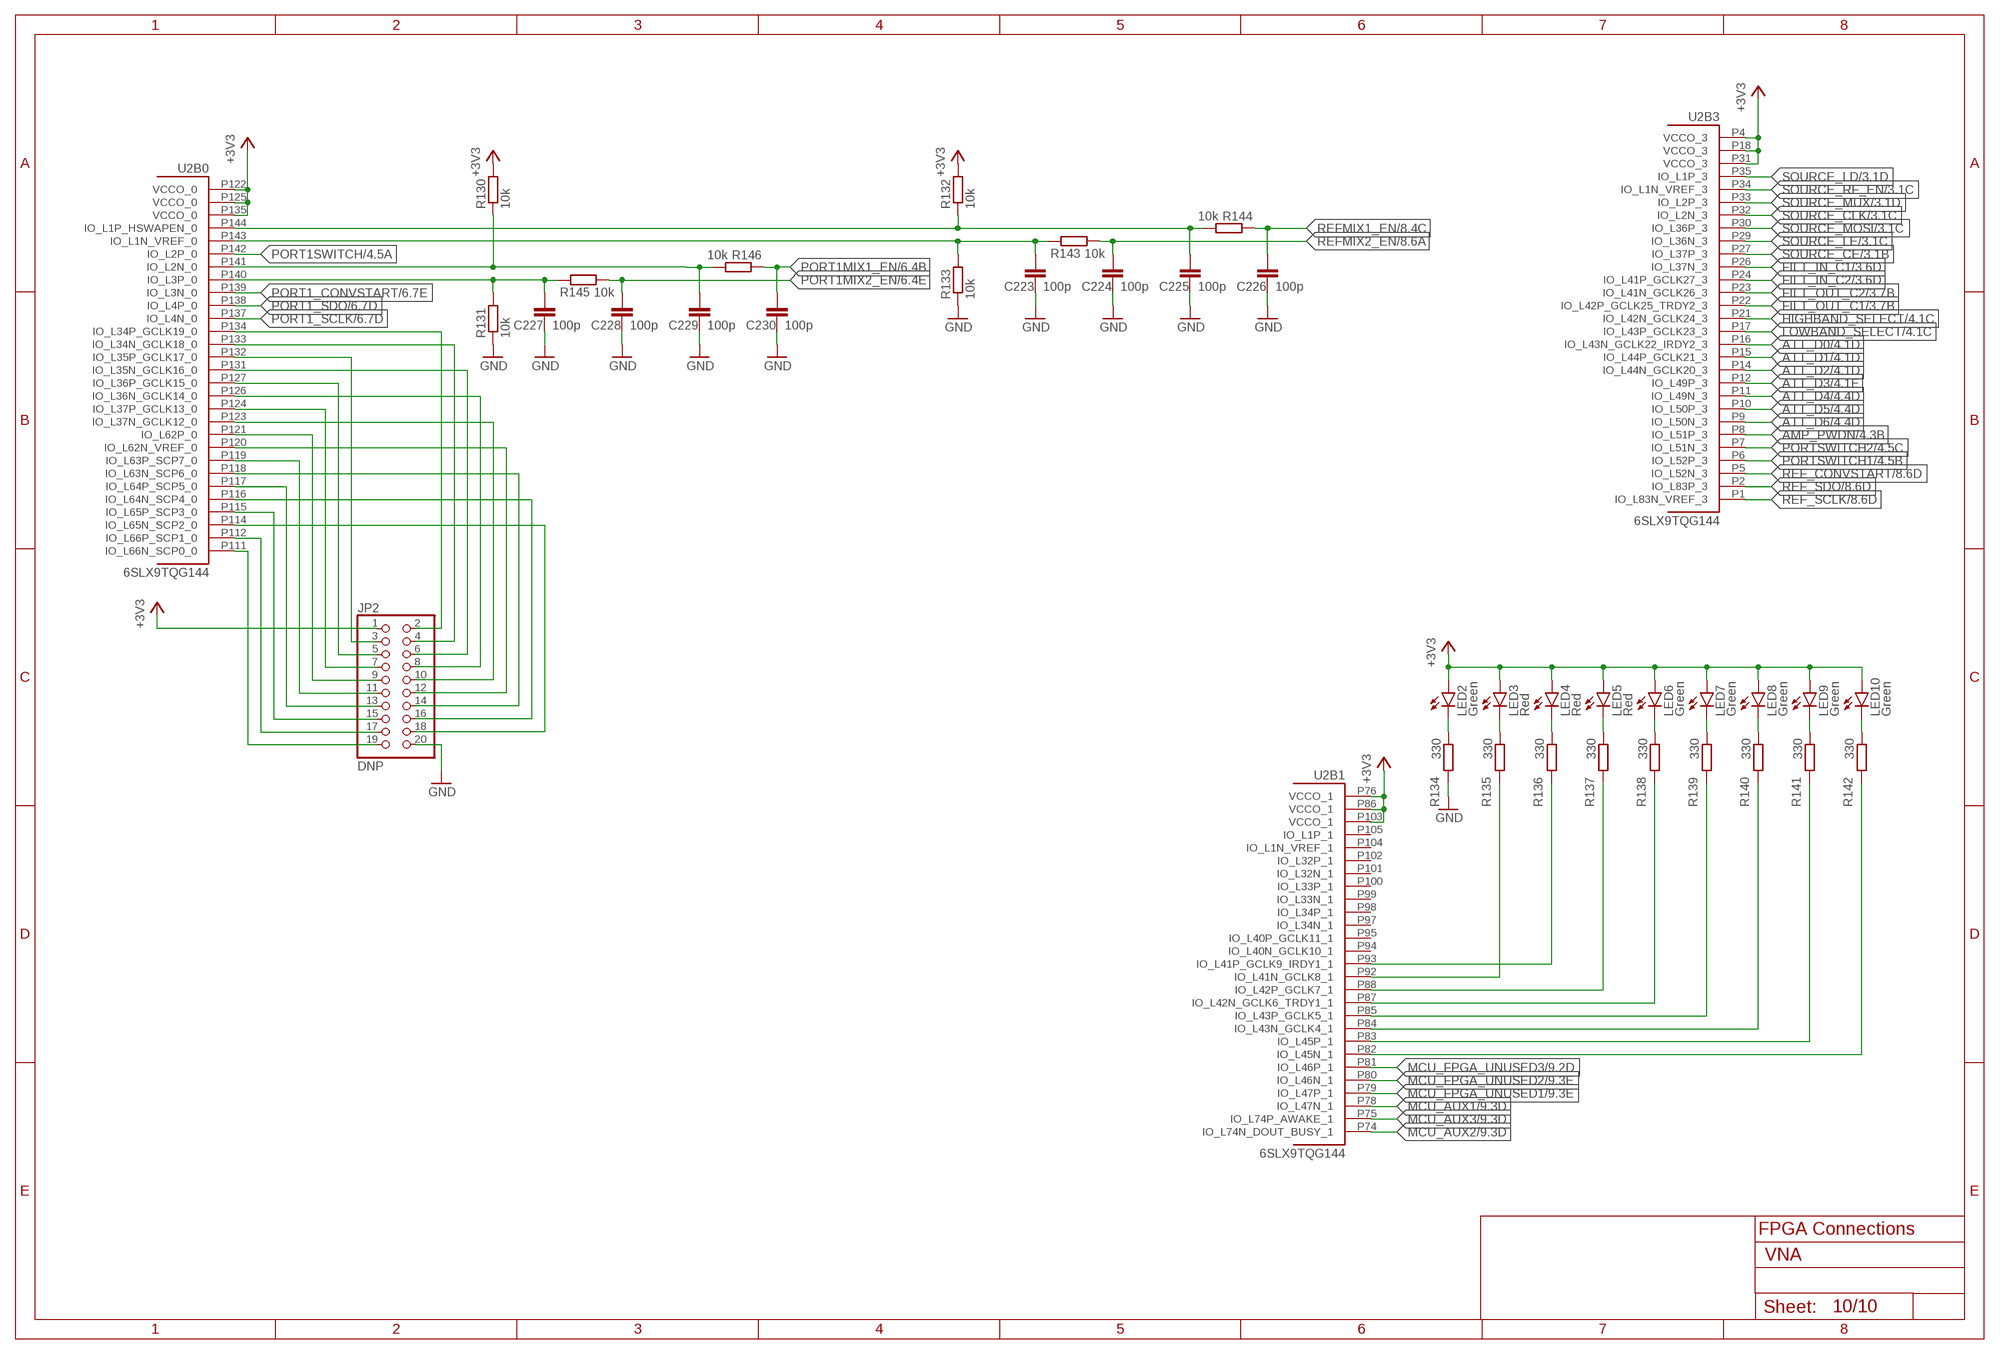
[diagram p9: schematic, sheet 10]

### Parts
C223  100p  C-EUC0402:2  [C0402]
C224  100p  C-EUC0402:2  [C0402]
C225  100p  C-EUC0402:2  [C0402]
C226  100p  C-EUC0402:2  [C0402]
C227  100p  C-EUC0402:2  [C0402]
C228  100p  C-EUC0402:2  [C0402]
C229  100p  C-EUC0402:2  [C0402]
C230  100p  C-EUC0402:2  [C0402]
JP2  DNP  PINHD-2X10  [2X10]
LED2  Green  LEDCHIPLED_0603  [CHIPLED_0603]
LED3  Red  LEDCHIPLED_0603  [CHIPLED_0603]
LED4  Red  LEDCHIPLED_0603  [CHIPLED_0603]
LED5  Red  LEDCHIPLED_0603  [CHIPLED_0603]
LED6  Green  LEDCHIPLED_0603  [CHIPLED_0603]
LED7  Green  LEDCHIPLED_0603  [CHIPLED_0603]
LED8  Green  LEDCHIPLED_0603  [CHIPLED_0603]
LED9  Green  LEDCHIPLED_0603  [CHIPLED_0603]
LED10  Green  LEDCHIPLED_0603  [CHIPLED_0603]
R130  10k  R-EU_R0402  [R0402]
R131  10k  R-EU_R0402  [R0402]
R132  10k  R-EU_R0402  [R0402]
R133  10k  R-EU_R0402  [R0402]
R134  330  R-EU_R0402  [R0402]
R135  330  R-EU_R0402  [R0402]
R136  330  R-EU_R0402  [R0402]
R137  330  R-EU_R0402  [R0402]
R138  330  R-EU_R0402  [R0402]
R139  330  R-EU_R0402  [R0402]
R140  330  R-EU_R0402  [R0402]
R141  330  R-EU_R0402  [R0402]
R142  330  R-EU_R0402  [R0402]
R143  10k  R-EU_R0402  [R0402]
R144  10k  R-EU_R0402  [R0402]
R145  10k  R-EU_R0402  [R0402]
R146  10k  R-EU_R0402  [R0402]

### Nets
+3V3: JP2.1 LED2.A LED3.A LED4.A LED5.A LED6.A LED7.A LED8.A LED9.A LED10.A R130.2 R132.2 U2.P4(B3:VCCO_3) U2.P18(B3:VCCO_3) U2.P31(B3:VCCO_3) U2.P76(B1:VCCO_1) U2.P86(B1:VCCO_1) U2.P103(B1:VCCO_1) U2.P122(B0:VCCO_0) U2.P125(B0:VCCO_0) U2.P135(B0:VCCO_0) ; also sheet 1,2,3,4,5,6,7,8,9
AMP_PWDN: U2.P8(B3:IO_L51P_3) ; also sheet 4
ATT_D0: U2.P16(B3:IO_L43N_GCLK22_IRDY2_3) ; also sheet 4
ATT_D1: U2.P15(B3:IO_L44P_GCLK21_3) ; also sheet 4
ATT_D2: U2.P14(B3:IO_L44N_GCLK20_3) ; also sheet 4
ATT_D3: U2.P12(B3:IO_L49P_3) ; also sheet 4
ATT_D4: U2.P11(B3:IO_L49N_3) ; also sheet 4
ATT_D5: U2.P10(B3:IO_L50P_3) ; also sheet 4
ATT_D6: U2.P9(B3:IO_L50N_3) ; also sheet 4
FILT_IN_C1: U2.P26(B3:IO_L37N_3) ; also sheet 3
FILT_IN_C2: U2.P24(B3:IO_L41P_GCLK27_3) ; also sheet 3
FILT_OUT_C1: U2.P22(B3:IO_L42P_GCLK25_TRDY2_3) ; also sheet 3
FILT_OUT_C2: U2.P23(B3:IO_L41N_GCLK26_3) ; also sheet 3
GND: C223.2 C224.2 C225.2 C226.2 C227.2 C228.2 C229.2 C230.2 JP2.20 R131.1 R133.1 R134.2 ; also sheet 1,2,3,4,5,6,7,8,9
HIGHBAND_SELECT: U2.P21(B3:IO_L42N_GCLK24_3) ; also sheet 4
LOWBAND_SELECT: U2.P17(B3:IO_L43P_GCLK23_3) ; also sheet 4
MCU_AUX1: U2.P78(B1:IO_L47N_1) ; also sheet 9
MCU_AUX2: U2.P74(B1:IO_L74N_DOUT_BUSY_1) ; also sheet 9
MCU_AUX3: U2.P75(B1:IO_L74P_AWAKE_1) ; also sheet 9
MCU_FPGA_UNUSED1: U2.P79(B1:IO_L47P_1) ; also sheet 9
MCU_FPGA_UNUSED2: U2.P80(B1:IO_L46N_1) ; also sheet 9
MCU_FPGA_UNUSED3: U2.P81(B1:IO_L46P_1) ; also sheet 9
N$169: C225.1 R132.1 R144.1 U2.P144(B0:IO_L1P_HSWAPEN_0)
N$170: C227.1 R131.2 R145.2 U2.P140(B0:IO_L3P_0)
N$173: C229.1 R130.1 R146.1 U2.P141(B0:IO_L2N_0)
N$175: R135.2 U2.P92(B1:IO_L41N_GCLK8_1)
N$179: R136.2 U2.P93(B1:IO_L41P_GCLK9_IRDY1_1)
N$194: JP2.2 U2.P134(B0:IO_L34P_GCLK19_0)
N$195: JP2.4 U2.P133(B0:IO_L34N_GCLK18_0)
N$196: JP2.3 U2.P132(B0:IO_L35P_GCLK17_0)
N$206: LED10.C R142.1
N$207: LED9.C R141.1
N$208: LED8.C R140.1
N$209: LED7.C R139.1
N$210: LED6.C R138.1
N$211: LED5.C R137.1
N$212: LED4.C R136.1
N$213: LED3.C R135.1
N$214: LED2.C R134.1
N$215: R142.2 U2.P82(B1:IO_L45N_1)
N$216: R141.2 U2.P83(B1:IO_L45P_1)
N$219: R140.2 U2.P84(B1:IO_L43N_GCLK4_1)
N$220: R139.2 U2.P85(B1:IO_L43P_GCLK5_1)
N$221: R138.2 U2.P87(B1:IO_L42N_GCLK6_TRDY1_1)
N$222: R137.2 U2.P88(B1:IO_L42P_GCLK7_1)
N$242: JP2.6 U2.P131(B0:IO_L35N_GCLK16_0)
N$243: JP2.5 U2.P127(B0:IO_L36P_GCLK15_0)
N$244: JP2.8 U2.P126(B0:IO_L36N_GCLK14_0)
N$245: JP2.7 U2.P124(B0:IO_L37P_GCLK13_0)
N$246: JP2.10 U2.P123(B0:IO_L37N_GCLK12_0)
N$247: JP2.9 U2.P121(B0:IO_L62P_0)
N$248: JP2.12 U2.P120(B0:IO_L62N_VREF_0)
N$249: JP2.11 U2.P119(B0:IO_L63P_SCP7_0)
N$250: JP2.14 U2.P118(B0:IO_L63N_SCP6_0)
N$251: JP2.13 U2.P117(B0:IO_L64P_SCP5_0)
N$252: JP2.16 U2.P116(B0:IO_L64N_SCP4_0)
N$253: JP2.15 U2.P115(B0:IO_L65P_SCP3_0)
N$254: JP2.18 U2.P114(B0:IO_L65N_SCP2_0)
N$255: JP2.17 U2.P112(B0:IO_L66P_SCP1_0)
N$256: JP2.19 U2.P111(B0:IO_L66N_SCP0_0)
N$312: C223.1 R133.2 R143.2 U2.P143(B0:IO_L1N_VREF_0)
PORT1_CONVSTART: U2.P139(B0:IO_L3N_0) ; also sheet 6
PORT1_SCLK: U2.P137(B0:IO_L4N_0) ; also sheet 6
PORT1_SDO: U2.P138(B0:IO_L4P_0) ; also sheet 6
PORT1MIX1_EN: C230.1 R146.2 ; also sheet 6
PORT1MIX2_EN: C228.1 R145.1 ; also sheet 6
PORT1SWITCH: U2.P142(B0:IO_L2P_0) ; also sheet 4
PORTSWITCH1: U2.P6(B3:IO_L52P_3) ; also sheet 4
PORTSWITCH2: U2.P7(B3:IO_L51N_3) ; also sheet 4
REF_CONVSTART: U2.P5(B3:IO_L52N_3) ; also sheet 8
REF_SCLK: U2.P1(B3:IO_L83N_VREF_3) ; also sheet 8
REF_SDO: U2.P2(B3:IO_L83P_3) ; also sheet 8
REFMIX1_EN: C226.1 R144.2 ; also sheet 8
REFMIX2_EN: C224.1 R143.1 ; also sheet 8
SOURCE_CE: U2.P27(B3:IO_L37P_3) ; also sheet 3
SOURCE_CLK: U2.P32(B3:IO_L2N_3) ; also sheet 3
SOURCE_LD: U2.P35(B3:IO_L1P_3) ; also sheet 3
SOURCE_LE: U2.P29(B3:IO_L36N_3) ; also sheet 3
SOURCE_MOSI: U2.P30(B3:IO_L36P_3) ; also sheet 3
SOURCE_MUX: U2.P33(B3:IO_L2P_3) ; also sheet 3
SOURCE_RF_EN: U2.P34(B3:IO_L1N_VREF_3) ; also sheet 3
Unconnected: U2.P94(B1:IO_L40N_GCLK10_1) U2.P95(B1:IO_L40P_GCLK11_1) U2.P97(B1:IO_L34N_1) U2.P98(B1:IO_L34P_1) U2.P99(B1:IO_L33N_1) U2.P100(B1:IO_L33P_1) U2.P101(B1:IO_L32N_1) U2.P102(B1:IO_L32P_1) U2.P104(B1:IO_L1N_VREF_1) U2.P105(B1:IO_L1P_1)

### Notes on the sheet
- FPGA Connections

## Library data of the parts
C1-C3 C7 C8 C10-C17 C49 C53 C78 C82 = VNA:C-EU: CAPACITOR, European symbol
C4-C6 C9 C29-C48 C51 C54-C77 C80 C83-C274 = VNA:C-EU*?:2: CAPACITOR, European symbol
C18-C28 C50 C52 C79 C81 = VNA:C-EU*?:1: CAPACITOR, European symbol
D1 = VNA:D-: DIODE
IC1 = VNA:MIC2253
IC2 = VNA:LM3370
IC3-IC6 = VNA:LDL212PU50R
IC7 = VNA:SI5351C
IC8 IC19 = VNA:AP2114
IC9 IC20 IC25 IC30 IC34 = VNA:NCP702
IC10 IC21 = VNA:MAX2871
IC11 IC12 = VNA:RFSW6042
IC13 IC16-IC18 = VNA:QPC6324
IC14 = VNA:RFSA3714
IC15 = VNA:TRF37A73
IC22 IC27 IC36 = VNA:LT5560
IC23 IC28 IC32 = VNA:THS4521IDGKR
IC24 IC29 IC33 = VNA:ADL5801
IC26 IC31 IC35 = VNA:MCP33131D-10-E/MS
IC37 = VNA:STM32G431CB
J1 = VNA:PJ-014D
J2 J3 = VNA:BU-1420701851
J4 = VNA:TYPE-C16P(073)
JP1 = VNA:PINHD-1X10: PIN HEADER
JP2 = VNA:PINHD-2X10: PIN HEADER
L1-L5 = VNA:SRN5040
L6-L10 L12 L13 L15-L17 L19-L23 L25-L29 L54-L65 = VNA:FERRITE
L11 L14 L18 L24 L30-L53 = VNA:INDUCTOR
LED1-LED10 = VNA:LED: LED OSRAM: - CHIPLED LG R971, LG N971, LY N971, LG Q971, LY Q971, LO R971, LY R971 LH N974, LH R974 LS Q976, LO Q976, LY Q976 LO Q996 - Hyper CHIPLED LW Q18S LB Q993, LB Q99A, LB R99A - SideLED LS A670, LO A670, LY A670, LG A670, LP A670 LB A673, LV A673, LT A673, LW A673 LH A674 LY A675 LS A676, LA A676, LO A676, LY A676, LW A676 LS A679, LY A679, LG A679 - Hyper Micro SIDELED® LS Y876, LA Y876, LO Y876, LY Y876 LT Y87S - SmartLED LW L88C, LW L88S LB L89C, LB L89S, LG L890 LS L89K, LO L89K, LY L89K LS L896, LA L896, LO L896, LY L896 - TOPLED LS T670, LO T670, LY T670, LG T670, LP T670 LSG T670, LSP T670, LSY T670, LOP T670, LYG T670 LG T671, LOG T671, LSG T671 LB T673, LV T673, LT T673, LW T673 LH T674 LS T676, LA T676, LO T676, LY T676, LB T676, LH T676, LSB T676, LW T676 LB T67C, LV T67C, LT T67C, LS T67K, LO T67K, LY T67K, LW E67C LS E67B, LA E67B, LO E67B, LY E67B, LB E67C, LV E67C, LT E67C LW T67C LS T679, LY T679, LG T679 LS T770, LO T770, LY T770, LG T770, LP T770 LB T773, LV T773, LT T773, LW T773 LH T774 LS E675, LA E675, LY E675, LS T675 LS T776, LA T776, LO T776, LY T776, LB T776 LHGB T686 LT T68C, LB T68C - Hyper Mini TOPLED® LB M676 - Mini TOPLED Santana® LG M470 LS M47K, LO M47K, LY M47K Source: http://www.osram.convergy.de LUXEON: - LUMILED® LXK2-PW12-R00, LXK2-PW12-S00, LXK2-PW14-U00, LXK2-PW14-V00 LXK2-PM12-R00, LXK2-PM12-S00, LXK2-PM14-U00 LXK2-PE12-Q00, LXK2-PE12-R00, LXK2-PE12-S00, LXK2-PE14-T00, LXK2-PE14-U00 LXK2-PB12-K00, LXK2-PB12-L00, LXK2-PB12-M00, LXK2-PB14-N00, LXK2-PB14-P00, LXK2-PB14-Q00 LXK2-PR12-L00, LXK2-PR12-M00, LXK2-PR14-Q00, LXK2-PR14-R00 LXK2-PD12-Q00, LXK2-PD12-R00, LXK2-PD12-S00 LXK2-PH12-R00, LXK2-PH12-S00 LXK2-PL12-P00, LXK2-PL12-Q00, LXK2-PL12-R00 Source: www.luxeon.com KINGBRIGHT: KA-3528ASYC Source: www.kingbright.com
LP1-LP3 = VNA:LP0603A
Q1 Q2 = VNA:SSM3J338R
R1-R39 R45 R46 R50 R53-R66 R72 R73 R76 R80-R181 = VNA:R-EU_: RESISTOR, European symbol
R40 R47-R49 = VNA:PAT0816-C-3DB-T5: 3dB pad attenuator
T1-T3 = VNA:B012-617DB-1-63-B331
TP1-TP19 = VNA:TP: Test pad
U1 = VNA:W25Q16BV: EEPROM 4 Mbit SPI Serial Flash7
U2 = VNA:6SLX9TQG144: Xilinx FPGA: 6SLX9TQG144
X1 X2 = VNA:SMA_CONNECTOR
Y1 = crystal-geyer_V1_0:KXO-TCXO-CMOS: TCXO : CMOS - Serie Model Size l/w/h [mm] Frequency Range Frequency Stability Temp. Range [°C] Output AECQ 200 availabel Datasheet KXO-86 KXO-84 KXO-83 KXO-82 2.5/2.0/0.7 3.2/2.5/1.0 5.0/3.2/1.5 7.0/5.0/2.4 13,0 ~ 40,0 MHz 10,0 ~ 40,0 MHz 10,0 ~ 40,0 MHz 10,0 ~ 30,0 MHz ±1,0 … ±2,5ppm ±1,0 … ±2,5ppm ±1,0 … ±3,0ppm ±1,0 … ±3,0ppm (*) -30°C …+75°C (*) -40°C …+85°C (*) -40°C …+85°C (*) -30°C …+80°C CMOS CMOS CMOS CMOS - - - - KXO-86.pdf <http://www.geyer-electronic.de/uploads/tx_userartikelfrequenz/GEYER-KXO-86-TCXO-HCMOS.pdf> KXO-84.pdf <http://www.geyer-electronic.de/uploads/tx_userartikelfrequenz/GEYER-KXO-84-TCXO-HCMOS.pdf> KXO-83.pdf <http://www.geyer-electronic.de/uploads/tx_userartikelfrequenz/GEYER-KXO-83-TCXO-HCMOS.pdf> KXO-82.pdf <http://www.geyer-electronic.de/uploads/tx_userartikelfrequenz/GEYER-KXO-82-TCXO-HCMOS.pdf> <http://www.geyer-electronic.de/fileadmin/template/img/logo-geyer-electronic.png> Details see: http://www.geyer-electronic.de/Frequenz-Produkte.9.0.html Created 2016-06-07, Hans Locher 2016 (C) Geyer Quartz Technology KXO86,KXO84,KXO83,KXO82;2550;3225;5032;7050;2,5x2,0;3,2x2,5;2.5x2.0;3.2x2.5,5,0x3,2;7,0x5,0,5.0x3.2,7.0x5.0